# EAGLE design light_controller (EAGLE 9.1.3)
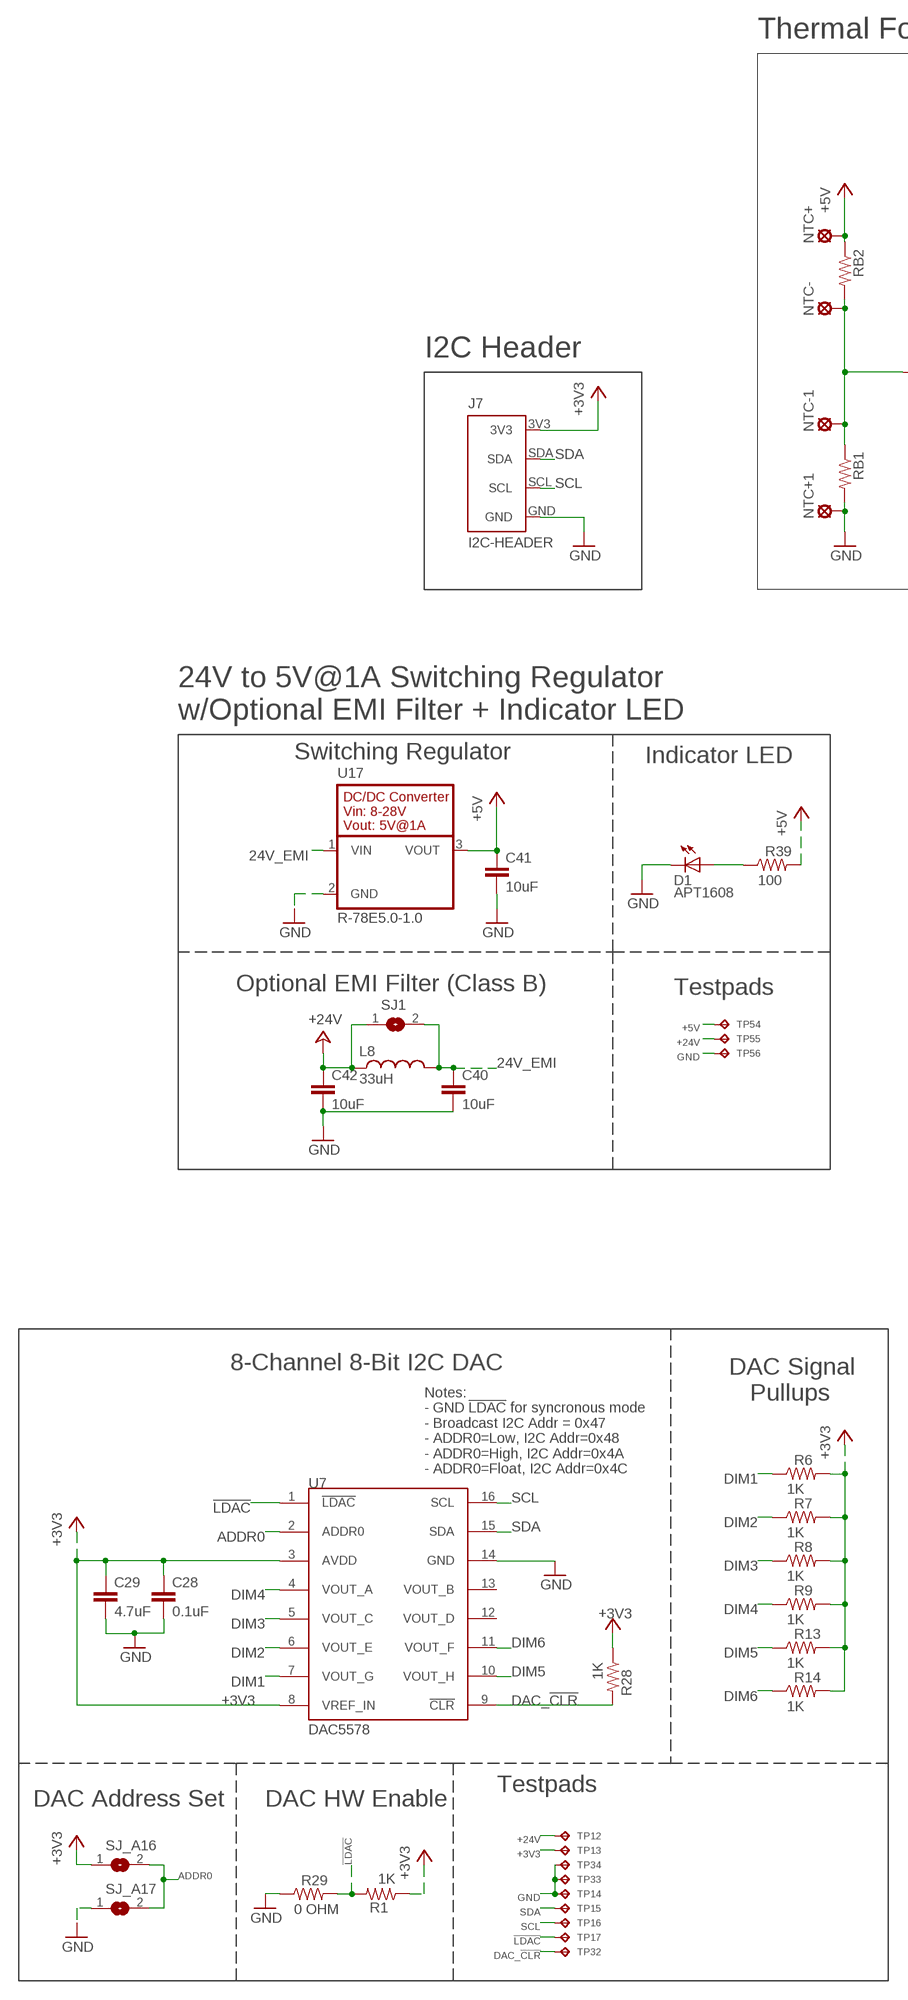
[diagram p0: schematic, sheet 1, part 1 of 2]
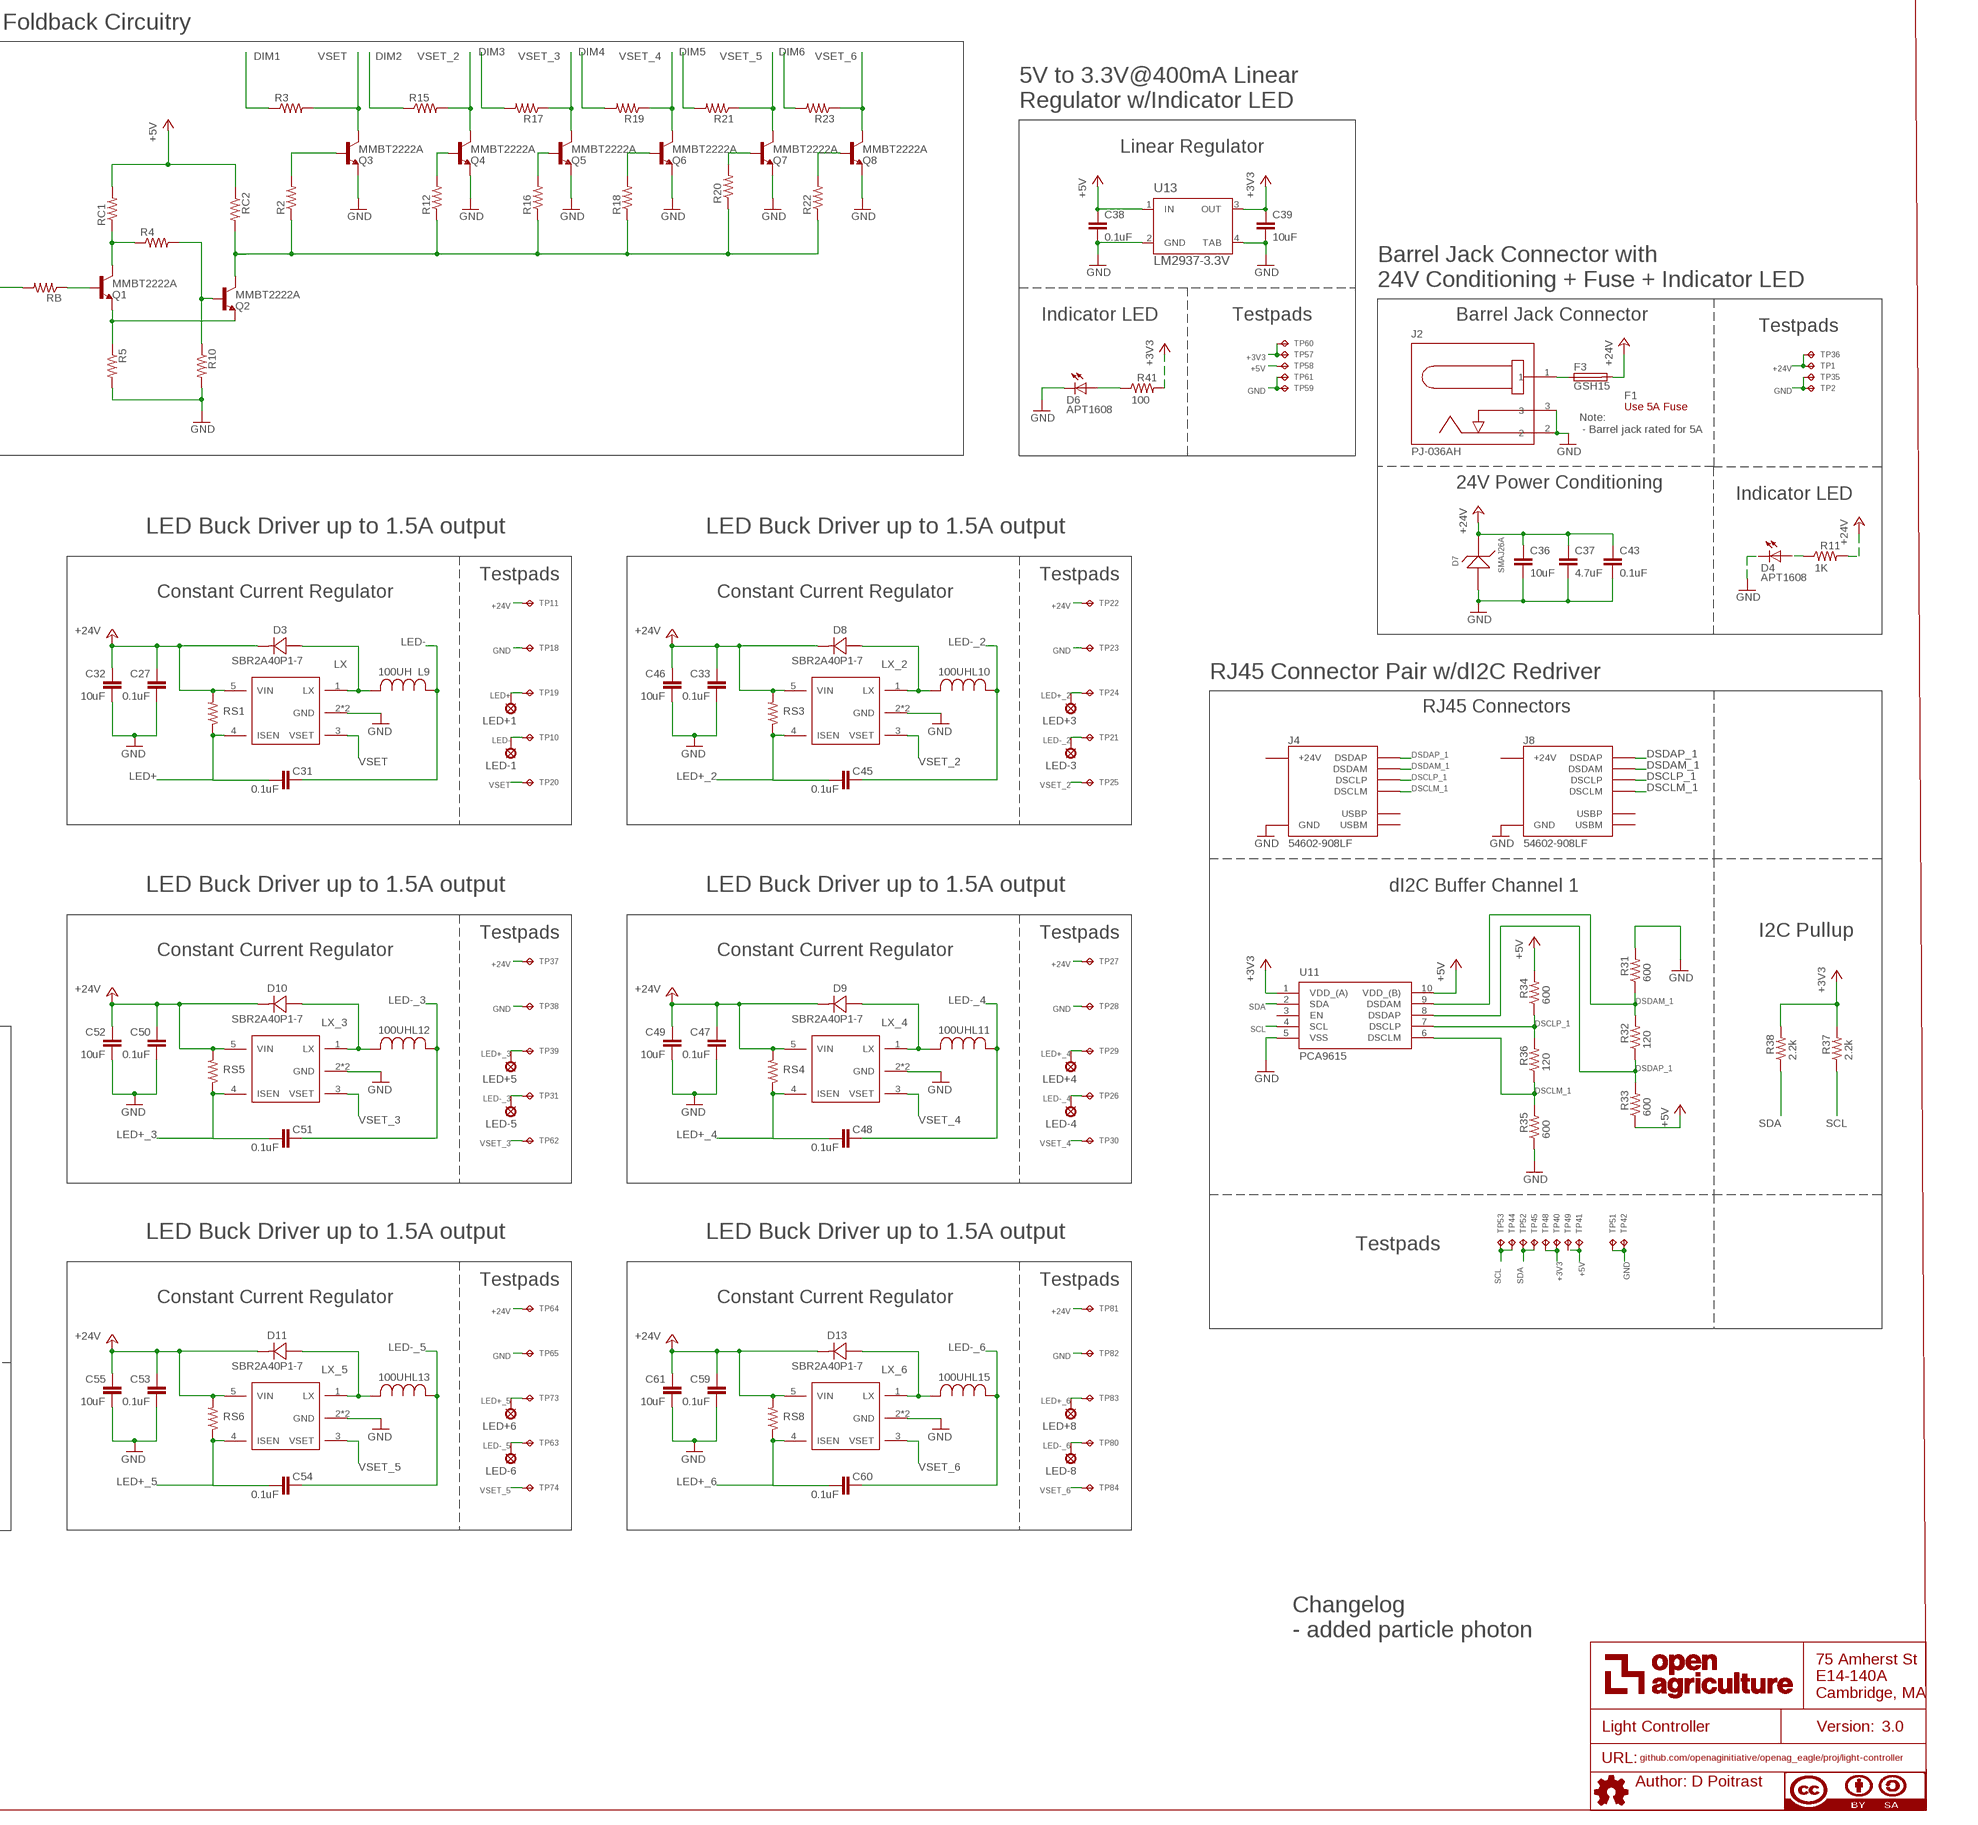
[diagram p1: schematic, sheet 1, part 2 of 2]

## Parts
C27  0.1uF  0.1UF-C0603C104K5RACTU  [C0603]
C28  0.1uF  0.1UF-C0603C104K5RACTU  [C0603]
C29  4.7uF  4.7UF-CL21A475KBQNNNE  [C0805]
C31  0.1uF  0.1UF-C0603C104K5RACTU  [C0603]
C32  10uF  10UF-GMK212BBJ106KG-T  [C0805]
C33  0.1uF  0.1UF-C0603C104K5RACTU  [C0603]
C36  10uF  10UF-GMK212BBJ106KG-T  [C0805]
C37  4.7uF  4.7UF-CL21A475KBQNNNE  [C0805]
C38  0.1uF  0.1UF-C0603C104K5RACTU  [C0603]
C39  10uF  10UF-GMK212BBJ106KG-T  [C0805]
C40  10uF  10UF-GMK212BBJ106KG-T  [C0805]
C41  10uF  10UF-GMK212BBJ106KG-T  [C0805]
C42  10uF  10UF-GMK212BBJ106KG-T  [C0805]
C43  0.1uF  0.1UF-C0603C104K5RACTU  [C0603]
C45  0.1uF  0.1UF-C0603C104K5RACTU  [C0603]
C46  10uF  10UF-GMK212BBJ106KG-T  [C0805]
C47  0.1uF  0.1UF-C0603C104K5RACTU  [C0603]
C48  0.1uF  0.1UF-C0603C104K5RACTU  [C0603]
C49  10uF  10UF-GMK212BBJ106KG-T  [C0805]
C50  0.1uF  0.1UF-C0603C104K5RACTU  [C0603]
C51  0.1uF  0.1UF-C0603C104K5RACTU  [C0603]
C52  10uF  10UF-GMK212BBJ106KG-T  [C0805]
C53  0.1uF  0.1UF-C0603C104K5RACTU  [C0603]
C54  0.1uF  0.1UF-C0603C104K5RACTU  [C0603]
C55  10uF  10UF-GMK212BBJ106KG-T  [C0805]
C59  0.1uF  0.1UF-C0603C104K5RACTU  [C0603]
C60  0.1uF  0.1UF-C0603C104K5RACTU  [C0603]
C61  10uF  10UF-GMK212BBJ106KG-T  [C0805]
D1  APT1608  APT1608CGCK  [CHIPLED_0603]
D3  SBR2A40P1-7  [POWERDI123]
D4  APT1608  APT1608CGCK  [CHIPLED_0603]
D6  APT1608  APT1608CGCK  [CHIPLED_0603]
D7  SMAJ26A  SMAJ26A-13-F  [SMA]
D8  SBR2A40P1-7  [POWERDI123]
D9  SBR2A40P1-7  [POWERDI123]
D10  SBR2A40P1-7  [POWERDI123]
D11  SBR2A40P1-7  [POWERDI123]
D13  SBR2A40P1-7  [POWERDI123]
F1  Use 5A Fuse  0217005.MXP  [FUSE-CARTRIDGE]
F3  GSH15  [GSH15]
J2  PJ-036AH  BARREL-JACK-PJ-036AH-SMT-TR  [BARREL-JACK-PJ-036AH]
J4  54602-908LF  RJ45-DI2C-USB-54602-908LFPTH  [RJ45-DI2C-USB-54602-908LF]
J7  I2C-HEADER  HEADER-I2C  [HEADER-I2C]
J8  54602-908LF  RJ45-DI2C-USB-54602-908LFPTH  [RJ45-DI2C-USB-54602-908LF]
L8  33uH  33UH-29333C  [29333C]
L9  100UH  100UH_BOURNES  [IND_BOURNS_SDR1307]
L10  100UH  100UH_BOURNES  [IND_BOURNS_SDR1307]
L11  100UH  100UH_BOURNES  [IND_BOURNS_SDR1307]
L12  100UH  100UH_BOURNES  [IND_BOURNS_SDR1307]
L13  100UH  100UH_BOURNES  [IND_BOURNS_SDR1307]
L15  100UH  100UH_BOURNES  [IND_BOURNS_SDR1307]
LED+1  SE14  [SE14]
LED+3  SE14  [SE14]
LED+4  SE14  [SE14]
LED+5  SE14  [SE14]
LED+6  SE14  [SE14]
LED+8  SE14  [SE14]
LED-1  SE14  [SE14]
LED-3  SE14  [SE14]
LED-4  SE14  [SE14]
LED-5  SE14  [SE14]
LED-6  SE14  [SE14]
LED-8  SE14  [SE14]
NTC+  SE14  [SE14]
NTC+1  SE14  [SE14]
NTC-  SE14  [SE14]
NTC-1  SE14  [SE14]
Q1  MMBT2222A  BCF30SMD  [SOT23-BEC]
Q2  MMBT2222A  BCF30SMD  [SOT23-BEC]
Q3  MMBT2222A  BCF30SMD  [SOT23-BEC]
Q4  MMBT2222A  BCF30SMD  [SOT23-BEC]
Q5  MMBT2222A  BCF30SMD  [SOT23-BEC]
Q6  MMBT2222A  BCF30SMD  [SOT23-BEC]
Q7  MMBT2222A  BCF30SMD  [SOT23-BEC]
Q8  MMBT2222A  BCF30SMD  [SOT23-BEC]
R1  1K  1K-ERJ-PB3D1001V  [RC0603N]
R2  R-US_R0805W  [R0805W]
R3  R-US_R0805W  [R0805W]
R4  R-US_R0805W  [R0805W]
R5  R-US_R0805W  [R0805W]
R6  1K  1K-ERJ-PB3D1001V  [RC0603N]
R7  1K  1K-ERJ-PB3D1001V  [RC0603N]
R8  1K  1K-ERJ-PB3D1001V  [RC0603N]
R9  1K  1K-ERJ-PB3D1001V  [RC0603N]
R10  R-US_R0805W  [R0805W]
R11  1K  1K-ERJ-PB3D1001V  [RC0603N]
R12  R-US_R0805W  [R0805W]
R13  1K  1K-ERJ-PB3D1001V  [RC0603N]
R14  1K  1K-ERJ-PB3D1001V  [RC0603N]
R15  R-US_R0805W  [R0805W]
R16  R-US_R0805W  [R0805W]
R17  R-US_R0805W  [R0805W]
R18  R-US_R0805W  [R0805W]
R19  R-US_R0805W  [R0805W]
R20  R-US_R0805W  [R0805W]
R21  R-US_R0805W  [R0805W]
R22  R-US_R0805W  [R0805W]
R23  R-US_R0805W  [R0805W]
R28  1K  1K-ERJ-PB3D1001V  [RC0603N]
R29  0 OHM  0OHM-RC0603JR-070RL  [RC0603N]
R31  600  600OHM-RC0603FR-07604RL  [RC0603N]
R32  120  120OHM-RC0603FR-07120RL  [RC0603N]
R33  600  600OHM-RC0603FR-07604RL  [RC0603N]
R34  600  600OHM-RC0603FR-07604RL  [RC0603N]
R35  600  600OHM-RC0603FR-07604RL  [RC0603N]
R36  120  120OHM-RC0603FR-07120RL  [RC0603N]
R37  2.2k  2.2K-RC0603JR-072K2L  [RC0603N]
R38  2.2k  2.2K-RC0603JR-072K2L  [RC0603N]
R39  100  100OHM-RC0603JR-07100RL  [RC0603N]
R41  100  100OHM-RC0603JR-07100RL  [RC0603N]
RB  R-US_R0805W  [R0805W]
RB1  R-US_R0805W  [R0805W]
RB2  R-US_R0805W  [R0805W]
RC1  R-US_R0805W  [R0805W]
RC2  R-US_R0805W  [R0805W]
RS1  6.34 ohm  6.3OHM-RC0805FR-076R34L  [R0805]
RS3  6.34 ohm  6.3OHM-RC0805FR-076R34L  [R0805]
RS4  6.34 ohm  6.3OHM-RC0805FR-076R34L  [R0805]
RS5  6.34 ohm  6.3OHM-RC0805FR-076R34L  [R0805]
RS6  6.34 ohm  6.3OHM-RC0805FR-076R34L  [R0805]
RS8  6.34 ohm  6.3OHM-RC0805FR-076R34L  [R0805]
SJ1  EMI-BYPASS  [EMI-BYPASS]
SJ_A16  SOLDERJUMPERREFLOW_NOPASTE  [SJ1]
SJ_A17  SOLDERJUMPERREFLOW_NOPASTE  [SJ1]
TP1  TPTP04R  [TP04R]
TP2  TPTP04R  [TP04R]
TP10  TPTP06R  [TP06R]
TP11  TPTP06R  [TP06R]
TP12  TPTP04R  [TP04R]
TP13  TPTP04R  [TP04R]
TP14  TPTP04R  [TP04R]
TP15  TPTP04R  [TP04R]
TP16  TPTP04R  [TP04R]
TP17  TPTP04R  [TP04R]
TP18  TPTP06R  [TP06R]
TP19  TPTP06R  [TP06R]
TP20  TPTP06R  [TP06R]
TP21  TPTP06R  [TP06R]
TP22  TPTP06R  [TP06R]
TP23  TPTP06R  [TP06R]
TP24  TPTP06R  [TP06R]
TP25  TPTP06R  [TP06R]
TP26  TPTP06R  [TP06R]
TP27  TPTP06R  [TP06R]
TP28  TPTP06R  [TP06R]
TP29  TPTP06R  [TP06R]
TP30  TPTP06R  [TP06R]
TP31  TPTP06R  [TP06R]
TP32  TPTP04R  [TP04R]
TP33  TPTP04R  [TP04R]
TP34  TPTP04R  [TP04R]
TP35  TPTP04R  [TP04R]
TP36  TPTP04R  [TP04R]
TP37  TPTP06R  [TP06R]
TP38  TPTP06R  [TP06R]
TP39  TPTP06R  [TP06R]
TP40  TPTP04R  [TP04R]
TP41  TPTP04R  [TP04R]
TP42  TPTP04R  [TP04R]
TP44  TPTP04R  [TP04R]
TP45  TPTP04R  [TP04R]
TP48  TPTP04R  [TP04R]
TP49  TPTP04R  [TP04R]
TP51  TPTP04R  [TP04R]
TP52  TPTP04R  [TP04R]
TP53  TPTP04R  [TP04R]
TP54  TPTP06R  [TP06R]
TP55  TPTP06R  [TP06R]
TP56  TPTP06R  [TP06R]
TP57  TPTP04R  [TP04R]
TP58  TPTP04R  [TP04R]
TP59  TPTP04R  [TP04R]
TP60  TPTP04R  [TP04R]
TP61  TPTP04R  [TP04R]
TP62  TPTP06R  [TP06R]
TP63  TPTP06R  [TP06R]
TP64  TPTP06R  [TP06R]
TP65  TPTP06R  [TP06R]
TP73  TPTP06R  [TP06R]
TP74  TPTP06R  [TP06R]
TP80  TPTP06R  [TP06R]
TP81  TPTP06R  [TP06R]
TP82  TPTP06R  [TP06R]
TP83  TPTP06R  [TP06R]
TP84  TPTP06R  [TP06R]
U7  DAC5578  DAC5578SPW  [TSSOP16]
U11  PCA9615  PCA9615DPJ  [SOP50P490X110-10N]
U13  LM2937-3.3V  LM2937IMP-3.3/NOPB  [MP04A]
U17  R-78E5.0-1.0  [R-78E5.0-1.0]
U$6  AUTHOR  [AUTHOR]
U$7  TITLE  [TITLE]
U$11  AL8861  [AL8861]
U$12  AL8861  [AL8861]
U$13  AL8861  [AL8861]
U$14  AL8861  [AL8861]
U$15  AL8861  [AL8861]
U$17  AL8861  [AL8861]

## Nets
24V_EMI: C40.1 L8.2 SJ1.2 U17.1(VIN)
24V_IN: F3.1 J2.1
!LDAC!: R1.2 R29.2 TP17.1(TP) U7.1(!LDAC!)
+3V3: C28.1 C29.1 C39.1 J7.3V3 R1.1 R6.2 R7.2 R8.2 R9.2 R13.2 R14.2 R28.1 R37.2 R38.2 R41.2 SJ_A16.1 TP13.1(TP) TP40.1(TP) TP48.1(TP) TP57.1(TP) TP60.1(TP) U7.3(AVDD) U7.8(VREF_IN) U11.1(VDD_(A)) U13.3(OUT)
+5V: C38.1 C41.1 NTC+.MP R33.1 R34.2 R39.2 RB2.1 RC1.2 RC2.1 TP41.1(TP) TP49.1(TP) TP54.TP TP58.1(TP) U11.10(VDD_(B)) U13.1(IN) U17.3(VOUT)
+24V: C27.1 C32.1 C33.1 C36.1 C37.1 C42.1 C43.1 C46.1 C47.1 C49.1 C50.1 C52.1 C53.1 C55.1 C59.1 C61.1 D3.- D7.1 D8.- D9.- D10.- D11.- D13.- F3.2 L8.1 R11.2 RS1.2 RS3.2 RS4.2 RS5.2 RS6.2 RS8.2 SJ1.1 TP1.1(TP) TP11.TP TP12.1(TP) TP22.TP TP27.TP TP36.1(TP) TP37.TP TP55.TP TP64.TP TP81.TP U$11.5(VIN) U$12.5(VIN) U$13.5(VIN) U$14.5(VIN) U$15.5(VIN) U$17.5(VIN)
ADDR0: SJ_A16.2 SJ_A17.2 U7.2(ADDR0)
DAC_!CLR!: R28.2 TP32.1(TP) U7.9(!CLR!)
DIM1: R3.1 R6.1 U7.7(VOUT_G)
DIM2: R7.1 R15.1 U7.6(VOUT_E)
DIM3: R8.1 R17.2 U7.5(VOUT_C)
DIM4: R9.1 R19.2 U7.4(VOUT_A)
DIM5: R13.1 R21.2 U7.10(VOUT_H)
DIM6: R14.1 R23.2 U7.11(VOUT_F)
DSCLM_1: J4.DSCLM(5)(DSCLM) J8.DSCLM(5)(DSCLM) R35.2 R36.1 U11.6(DSCLM)
DSCLP_1: J4.DSCLP(4)(DSCLP) J8.DSCLP(4)(DSCLP) R34.1 R36.2 U11.7(DSCLP)
DSDAM_1: J4.DSDAM(2)(DSDAM) J8.DSDAM(2)(DSDAM) R31.1 R32.2 U11.9(DSDAM)
DSDAP_1: J4.DSDAP(1)(DSDAP) J8.DSDAP(1)(DSDAP) R32.1 R33.2 U11.8(DSDAP)
GND: C27.2 C28.2 C29.2 C32.2 C33.2 C36.2 C37.2 C38.2 C39.2 C40.2 C41.2 C42.2 C43.2 C46.2 C47.2 C49.2 C50.2 C52.2 C53.2 C55.2 C59.2 C61.2 D1.C D4.C D6.C D7.2 J2.2 J2.3 J4.GND(3)(GND) J7.GND J8.GND(3)(GND) NTC+1.MP Q3.E Q4.E Q5.E Q6.E Q7.E Q8.E R5.2 R10.2 R29.1 R31.2 R35.1 RB1.2 SJ_A17.1 TP2.1(TP) TP14.1(TP) TP18.TP TP23.TP TP28.TP TP33.1(TP) TP34.1(TP) TP35.1(TP) TP38.TP TP42.1(TP) TP51.1(TP) TP56.TP TP59.1(TP) TP61.1(TP) TP65.TP TP82.TP U7.14(GND) U11.5(VSS) U13.2(GND) U13.4(TAB) U17.2(GND) U$11.2(GND) U$11.44(GND) U$12.2(GND) U$12.44(GND) U$13.2(GND) U$13.44(GND) U$14.2(GND) U$14.44(GND) U$15.2(GND) U$15.44(GND) U$17.2(GND) U$17.44(GND)
LED+: C31.2 LED+1.MP RS1.1 TP19.TP U$11.4(ISEN)
LED+_2: C45.2 LED+3.MP RS3.1 TP24.TP U$12.4(ISEN)
LED+_3: C51.2 LED+5.MP RS5.1 TP39.TP U$14.4(ISEN)
LED+_4: C48.2 LED+4.MP RS4.1 TP29.TP U$13.4(ISEN)
LED+_5: C54.2 LED+6.MP RS6.1 TP73.TP U$15.4(ISEN)
LED+_6: C60.2 LED+8.MP RS8.1 TP83.TP U$17.4(ISEN)
LED-: C31.1 L9.2 LED-1.MP TP10.TP
LED-_2: C45.1 L10.2 LED-3.MP TP21.TP
LED-_3: C51.1 L12.2 LED-5.MP TP31.TP
LED-_4: C48.1 L11.2 LED-4.MP TP26.TP
LED-_5: C54.1 L13.2 LED-6.MP TP63.TP
LED-_6: C60.1 L15.2 LED-8.MP TP80.TP
LX: D3.+ L9.1 U$11.1(LX)
LX_2: D8.+ L10.1 U$12.1(LX)
LX_3: D10.+ L12.1 U$14.1(LX)
LX_4: D9.+ L11.1 U$13.1(LX)
LX_5: D11.+ L13.1 U$15.1(LX)
LX_6: D13.+ L15.1 U$17.1(LX)
N$1: D1.A R39.1
N$3: D6.A R41.1
N$4: D4.A R11.1
N$5: Q1.B RB.1
N$6: Q1.C R4.1 RC1.1
N$7: Q1.E Q2.E R5.1
N$8: Q3.B R2.2
N$9: Q2.B R4.2 R10.1
N$10: Q4.B R12.2
N$11: Q2.C R2.1 R12.1 R16.1 R18.1 R20.1 R22.1 RC2.2
N$12: Q5.B R16.2
N$22: Q6.B R18.2
N$23: Q7.B R20.2
N$24: Q8.B R22.2
N$25: NTC-1.MP NTC-.MP RB1.1 RB2.2 RB.2
SCL: J7.SCL R37.1 TP16.1(TP) TP44.1(TP) TP53.1(TP) U7.16(SCL) U11.4(SCL)
SDA: J7.SDA R38.1 TP15.1(TP) TP45.1(TP) TP52.1(TP) U7.15(SDA) U11.2(SDA)
VSET: Q3.C R3.2 TP20.TP U$11.3(VSET)
VSET_2: Q4.C R15.2 TP25.TP U$12.3(VSET)
VSET_3: Q5.C R17.1 TP62.TP U$14.3(VSET)
VSET_4: Q6.C R19.1 TP30.TP U$13.3(VSET)
VSET_5: Q7.C R21.1 TP74.TP U$15.3(VSET)
VSET_6: Q8.C R23.1 TP84.TP U$17.3(VSET)
Unconnected: J4.24V(6)(+24V) J4.USBM(8)(USBM) J4.USBP(7)(USBP) J8.24V(6)(+24V) J8.USBM(8)(USBM) J8.USBP(7)(USBP) U7.12(VOUT_D) U7.13(VOUT_B) U11.3(EN)

## Notes on the sheet
- 6-Channel 24V, 700mA (per channel) Current Regulator Module w/I2C Controlled Dimming via PWM or Analog Signaling
- Thermal Foldback Circuitry
- 5V to 3.3V@400mA Linear 
  Regulator w/Indicator LED
- Linear Regulator
- I2C Header
- Barrel Jack Connector with
  24V Conditioning + Fuse + Indicator LED
- Indicator LED | Testpads | Barrel Jack Connector
- Testpads
- Note:
   - Barrel jack rated for 5A
- 24V Power Conditioning
- Indicator LED
- LED Buck Driver up to 1.5A output | LED Buck Driver up to 1.5A output
- 24V to 5V@1A Switching Regulator
  w/Optional EMI Filter + Indicator LED
- Testpads | Testpads
- Switching Regulator | Indicator LED
- Constant Current Regulator | Constant Current Regulator
- RJ45 Connector Pair w/dI2C Redriver
- RJ45 Connectors
- Optional EMI Filter (Class B) | Testpads
- LED Buck Driver up to 1.5A output | LED Buck Driver up to 1.5A output | dI2C Buffer Channel 1
- Testpads | Testpads | I2C Pullup
- Constant Current Regulator | Constant Current Regulator
- 8-Channel 8-Bit I2C DAC
- DAC Signal 
     Pullups
- Notes:
  - GND !LDAC! for syncronous mode
  - Broadcast I2C Addr = 0x47
  - ADDR0=Low, I2C Addr=0x48
  - ADDR0=High, I2C Addr=0x4A
  - ADDR0=Float, I2C Addr=0x4C
- LED Buck Driver up to 1.5A output | LED Buck Driver up to 1.5A output
- Testpads
- Testpads | Testpads
- Constant Current Regulator | Constant Current Regulator
- Testpads
- DAC Address Set | DAC HW Enable
- Changelog
  - added particle photon

## Library data of the parts
C27 C28 C31 C33 C38 C43 C45 C47 C48 C50 C51 C53 C54 C59 C60 = openag-capacitors:0.1UF-C0603C104K5RACTU: CAP CER 0.1UF 50V X7R 0603 Description: 0.1µF ±10% 50V Ceramic Capacitor X7R 0603 (1608 Metric) Technical Specifications: Capacitance: 0.1µF Tolerance: ±10% Rated Voltage: 50V Temperature Coefficient: X7R Operating Temperature: -55°C ~ 125°C Package / Case: 0603 (1608 Metric) Datasheet(s): X7R Dielectric, 6.3-250 VDC <https://search.kemet.com/component-edge/download/datasheet/C0603C104K5RACTU.pdf> Vendor(s): Digikey: 399-5089-1-ND <https://www.digikey.com/product-detail/en/kemet/C0603C104K5RACTU/399-5089-1-ND/1465623>; MANUFACTURER: Kemet; MPN: C0603C104K5RACTU; VENDOR: Digikey; VLINK: https://www.digikey.com/product-detail/en/kemet/C0603C104K5RACTU/399-5089-1-ND/1465623; VPN: 399-5089-1-ND
C29 C37 = openag-capacitors:4.7UF-CL21A475KBQNNNE: CAP CER 4.7UF 50V X5R 0805 Description: 4.7µF ±10% 50V Ceramic Capacitor X5R 0805 (2012 Metric) Technical Specifications: Capacitance: 4.7uF Tolerance: ±10% Rated Voltage: 50V Temperature Coefficient: X5R Operating Temperature: -55°C ~ 85°C Package/Case: 0805 (2012 Metric) Datasheet(s): CL21A475KBQNNNE Characteristics <http://www.samsungsem.com/kr/front/downloadcms.do?path=/kr/support/product-search/mlcc/__icsFiles/afieldfile/2014/11/05&fileName=C_CL21A475KBQNNNE.pdf> Vendor(s): Digikey: 1276-1248-1-ND <https://www.digikey.com/product-detail/en/samsung-electro-mechanics/CL21A475KBQNNNE/1276-1248-1-ND/3889334>; MANUFACTURER: Samsung; MPN: CL21A475KBQNNNE; VENDOR: Digikey; VLINK: https://www.digikey.com/product-detail/en/samsung-electro-mechanics/CL21A475KBQNNNE/1276-1248-1-ND/3889334; VPN: 1276-1248-1-ND
C32 C36 C39-C42 C46 C49 C52 C55 C61 = openag-capacitors:10UF-GMK212BBJ106KG-T: CAP CER 10UF 35V X5R 0805 Description: 10µF ±10% 35V Ceramic Capacitor X5R 0805 (2012 Metric) Technical Specifications: Capacitance: 10µF Tolerance: ±10% Rated Voltage: 35V Temperature Coefficient: X5R Operating Temperature: -55°C ~ 85°C Package / Case: 0805 (2012 Metric) Datasheet(s): GMK212BBJ106KG-T Spec <http://ds.yuden.co.jp/TYCOMPAS/ut/detail.do?productNo=GMK212BBJ106KG-T&fileName=GMK212BBJ106KG-T_SS&mode=specSheetDownload> Vendor(s): Digikey: 587-4893-1-ND <https://www.digikey.com/product-detail/en/taiyo-yuden/GMK212BBJ106KG-T/587-4893-1-ND/6563736>; MANUFACTURER: Taiyo Yuden; MPN: GMK212BBJ106KG-T; VENDOR: Digikey; VLINK: https://www.digikey.com/product-detail/en/taiyo-yuden/GMK212BBJ106KG-T/587-4893-1-ND/6563736; VPN: 587-4893-1-ND
D1 D4 D6 = openag-diodes:APT1608CGCK: LED GREEN CLEAR 0603 SMD Description: Green 570nm LED Indication - Discrete 2.1V 0603 (1608 Metric) Technical Specifications: Color: Green Lens Color: Colorless Lens Transparency: Clear Millicandela Rating: 50mcd Lens Style/Size: Rectangle with Flat Top, 1.20mm x 0.80mm Voltage - Forward (Vf) (Typ): 2.1V Current - Test: 20mA Viewing Angle: 120° Mounting Type: Surface Mount Wavelength - Dominant: 570nm Wavelength - Peak: 574nm Package / Case: 0603 (1608 Metric) Supplier Device Package: Chip LED Size / Dimension: 1.60mm L x 0.80mm W Height (Max): 0.75mm Datasheet(s): APT1608CGCK <http://www.kingbrightusa.com/images/catalog/SPEC/APT1608CGCK.pdf> Vendor(s): Digikey: 754-1116-1-ND <https://www.digikey.com/product-detail/en/kingbright/APT1608CGCK/754-1116-1-ND/1747833#>; MANUFACTURER: Kingbright; MPN: APT1608CGCK; VENDOR: Digikey; VLINK: https://www.digikey.com/product-detail/en/kingbright/APT1608CGCK/754-1116-1-ND/1747833#; VPN: 754-1116-1-ND
D3 D8-D11 D13 = openag-diodes:SBR2A40P1-7: DIODE SBR 40V 2A POWERDI123 Description: Diode Super Barrier 40V 2A Surface Mount PowerDI™ 123 Technical Specifications: Diode Type: Super Barrier Voltage - DC Reverse (Vr) (Max): 40V Current - Average Rectified (Io): 2A Voltage - Forward (Vf) (Max) @ If: 500mV @ 2A Speed: Standard Recovery >500ns, > 200mA (Io) Current - Reverse Leakage @ Vr: 100µA @ 40V Mounting Type: Surface Mount Package / Case: POWERDI®123 Supplier Device Package: PowerDI™ 123 Operating Temperature - Junction: -65°C ~ 150°C Base Part Number: SBR2A40 Datasheet(s): SBR2A40P1 <https://www.diodes.com/assets/Datasheets/SBR2A40P1.pdf> Vendor(s): Digikey: SBR2A40P1DITR-ND <https://www.digikey.com/product-detail/en/diodes-incorporated/SBR2A40P1-7/SBR2A40P1DITR-ND/1681825>; MANUFACTURER: Diodes Incorporated; MPN: SBR2A40P1-7; VENDOR: Digikey; VLINK: https://www.digikey.com/product-detail/en/diodes-incorporated/SBR2A40P1-7/SBR2A40P1DITR-ND/1681825; VPN: SBR2A40P1DITR-ND
D7 = openag-diodes:SMAJ26A-13-F: TVS DIODE 26VWM 42.1VC SMA Description: TVS DIODE 26VWM 42.1VC SMA Technical Specifications: Type: Zener Voltage - Reverse Standoff (Typ): 26V Voltage - Breakdown (Min): 28.9V Voltage - Clamping (Max) @ Ipp: 42.1V Current - Peak Pulse (10/1000µs): 9.5A Power - Peak Pulse: 400W Power Line Protection: No Operating Temperature: -55°C ~ 150°C (TJ) DO-214AC, SMA Datasheet(s): SMAJ5.0(C)A - SMAJ200(C)A Vendor(s): Digikey: SMAJ26A-FDICT-ND <https://www.digikey.com/product-detail/en/diodes-incorporated/SMAJ26A-13-F/SMAJ26A-FDICT-ND/806583>; MANUFACTURER: Diodes Incorporated; MPN: SMAJ26A-13-F; VENDOR: Digikey; VLINK: https://www.digikey.com/product-detail/en/diodes-incorporated/SMAJ26A-13-F/SMAJ26A-FDICT-ND/806583; VPN: SMAJ26A-FDICT-ND
F1 = openag-fuses:0217005.MXP: FUSE GLASS 5A 250VAC 5X20MM Description: FUSE GLASS 5A 250VAC 5X20MM Technical Specifications: Fuse Type: Cartridge, Glass Current Rating: 5A Voltage Rating - AC: 250V Response Time: Fast Package / Case: 5mm x 20mm Mounting Type: Holder Breaking Capacity @ Rated Voltage: 50A Melting I²t: 42.795 Approvals: BSI, CE, CCC, CSA, KC, PSE, SEMKO, UR, VDE Operating Temperature: -55°C ~ 125°C Size / Dimension: 0.205" Dia x 0.787" L (5.20mm x 20.00mm) DC Cold Resistance: 0.0137 Ohms Datasheet(s): 217 Series Datasheet <http://www.littelfuse.com/~/media/electronics/datasheets/fuses/littelfuse_fuse_217_datasheet.pdf.pdf> Vendor(s): Digikey: F1725-ND <https://www.digikey.com/product-detail/en/littelfuse-inc/0217005.MXP/F1725-ND/777549#>; MANUFACTURER: Littelfuse Inc.; MPN: 0217005.MXP; VENDOR: Digikey; VLINK: https://www.digikey.com/product-detail/en/littelfuse-inc/0217005.MXP/F1725-ND/777549; VPN: F1725-ND
F3 = openag-fuses:GSH15: FUSE BLOCK CART 250V 6.3A PCB Description: Fuse Block 6.3A 250V 1 Circuit Cartridge PCB Technical Specifications: Fuseholder Type: Block Fuse Type: Cartridge For Use With/Related Products: 5mm x 20mm Fuse Size: 5mm x 20mm Number of Circuits: 1 Voltage: 250V Current Rating: 6.3A Mounting Type: PCB Orientation: Horizontal Termination Style: PC Pin Contact Material: Copper Alloy Contact Finish: Tin Datasheet(s): 649 Series <http://www.littelfuse.com/~/media/electronics/datasheets/fuse_blocks/littelfuse_fuse_block_649_datasheet.pdf.pdf> Vendor(s): Digikey: WK0011-ND <https://www.digikey.com/product-detail/en/littelfuse-inc/64900001039/WK0011-ND/245470>; MANUFACTURER: Littelfuse Inc.; MPN: 64900001039; VENDOR: Digikey; VLINK: https://www.digikey.com/product-detail/en/littelfuse-inc/64900001039/WK0011-ND/245470; VPN: WK0011-ND
J2 = openag-connectors:BARREL-JACK-PJ-036AH-SMT-TR: CONN PWR JACK 2X5.5MM SOLDER Description: Power Barrel Connector Jack 2.10mm ID (0.083"), 5.50mm OD (0.217") Surface Mount, Right Angle Technical Specifications: Connector Type: Jack Gender: Male Industry Recognized Mating Diameter: 2.10mm ID (0.083"), 5.50mm OD (0.217") Actual Diameter: 0.078" (2.00mm ID), 0.248" (6.30mm OD) Number of Positions/Contacts: 2 Conductors, 3 Contacts Internal Switch(s): Single Switch, Normally Closed Mounting Type: Surface Mount, Right Angle Termination: Solder Shielding: Unshielded Voltage - Rated: 24VDC Current Rating: 5A Mating Length/Depth: 0.360" (9.15mm) Contact Material - Plating: Silver Operating Temperature: -25°C ~ 85°C Housing Material: Polyamide (PA6T), Nylon 6T Contact Material: Brass; Copper Alloy Body Color: Black Datasheet(s): PJ-036AH-SMT-TR <http://www.cui.com/product/resource/digikeypdf/pj-036ah-smt-tr.pdf> Vendor(s): Digikey: CP-036AHPJCT-ND <https://www.digikey.com/product-detail/en/cui-inc/PJ-036AH-SMT-TR/CP-036AHPJCT-ND/1530994>; MANUFACTURER: CUI Inc.; MPN: PJ-036AH-SMT-TR; VENDOR: Digikey; VLINK: https://www.digikey.com/product-detail/en/cui-inc/PJ-036AH-SMT-TR/CP-036AHPJCT-ND/1530994; VPN: CP-036AHPJCT-ND
J4 J8 = openag-connectors:RJ45-DI2C-USB-54602-908LF: CONN MOD JACK 8P8C R/A UNSHLD Description: Jack Modular Connector 8p8c (RJ45, Ethernet) 90° Angle (Right) Unshielded Cat3 Technical Specifications: Connector Type: Jack Number of Positions/Contacts: 8p8c (RJ45, Ethernet) Number of Ports: 1 Number of Rows: 1 Mounting Type: Through Hole Orientation: 90° Angle (Right) Termination: Solder Shielding: Unshielded Ratings: Cat3 Features: Board Lock LED Color: Does Not Contain LED Tab Direction: Down Contact Material: Copper Alloy Contact Finish: Gold Contact Finish Thickness: 15µin (0.38µm) Housing Material: Polyester, Glass Filled Operating Temperature: -40°C ~ 70°C Datasheet(s): 54601-x04(zzz)WPLF Drawing <http://cdn.amphenol-icc.com/media/wysiwyg/files/drawing/c-bmj-0102.pdf> Vendor(s): Digikey: 609-1046-ND <https://www.digikey.com/product-detail/en/amphenol-fci/54602-908LF/609-1046-ND/1001360>; MANUFACTURER: Amphenol FCI; MPN: 54602-908LF; VENDOR: Digikey; VLINK: https://www.digikey.com/product-detail/en/amphenol-fci/54602-908LF/609-1046-ND/1001360; VPN: 609-1046-ND
J7 = openag-connectors:HEADER-I2C: 100 MIL HEADER I2C CONNECTIONS; MPN: N/A
L8 = openag-inductors:33UH-29333C: FIXED IND 33UH 1A 120 MOHM SMD Description: 33µH Shielded Wirewound Inductor 1A 120 mOhm Max Nonstandard Technical Specifications: Type: Wirewound Inductance: 33µH Current Rating: 1A Shielding: Shielded DC Resistance (DCR): 120 mOhm Max Operating Temperature: -40°C ~ 85°C Frequency - Test: 10kHz Mounting Type: Surface Mount Package / Case: Nonstandard Size / Dimension: 0.283" L x 0.283" W (7.20mm x 7.20mm) Height - Seated (Max): 0.157" (4.00mm) Datasheet(s): 2900 Series <https://www.murata-ps.com/data/magnetics/kmp_2900.pdf> Vendor(s): Digikey: 811-1138-1-ND <https://www.digikey.com/product-detail/en/murata-power-solutions-inc/29333C/811-1138-1-ND/1924860>; MANUFACTURER: Murata Power Solutions Inc.; MPN: 29333C; VENDOR: Digikey; VLINK: https://www.digikey.com/product-detail/en/murata-power-solutions-inc/29333C/811-1138-1-ND/1924860; VPN: 811-1138-1-ND
L9-L13 L15 = openag-inductors:100UH_BOURNES: Bourne - FIXED IND 100UH 1.9A 180 MOHM Technical Specifications: Inductance: 100uH Rated Current: 1.9A Saturation Current: 3.0A DC Resistance: 180mΩ Operating Temperature: -40° C to 125°C Datasheet(s): 100uH Bourne <http://www.bourns.com/docs/Product-Datasheets/SDR1307.pdf> Vendors: Digikey: SDR1307-101KLCT-ND <https://www.digikey.com/product-detail/en/bourns-inc/SDR1307-101KL/SDR1307-101KLCT-ND/3437739>
LED+1 LED+3-LED+6 LED+8 LED-1 LED-3-LED-6 LED-8 NTC+ NTC+1 NTC- NTC-1 = solpad:SE14: SOLDER PAD E1553, drill 1,4mm, distributor Buerklin, 07F820
Q1-Q8 = transistor-npn:BCF30*: NPN Transistor
R1 R6-R9 R11 R13 R14 R28 = openag-resistors:1K-ERJ-PB3D1001V: RES SMD 1K OHM 0.5% 1/5W 0603 Description: 1 kOhms ±0.5% 0.2W, 1/5W Chip Resistor 0603 (1608 Metric) Automotive AEC-Q200, Pulse Withstanding Thick Film Technical Specifications: Resistance: 1 kOhms Tolerance: ±0.5% Power: 0.2W, 1/5W Operating Temperature: -55°C ~ 155°C Package / Case: 0603 (1608 Metric) Datasheet(s): ERJ-PB3, PB6 Series, High Precision Datasheet <https://industrial.panasonic.com/cdbs/www-data/pdf/RDM0000/AOA0000C328.pdf> Vendor(s): Digikey: P20283CT-ND <https://www.digikey.com/product-detail/en/panasonic-electronic-components/ERJ-PB3D1001V/P20283CT-ND/6214538>; MANUFACTURER: Panasonic; MPN: P20283CT-ND; VENDOR: Digikey; VLINK: https://www.digikey.com/product-detail/en/panasonic-electronic-components/ERJ-PB3D1001V/P20283CT-ND/6214538; VPN: P20283CT-ND
R2-R5 R10 R12 R15-R23 RB RB1 RB2 RC1 RC2 = rcl:R-US_: RESISTOR, American symbol; SPICEPREFIX: R
R29 = openag-resistors:0OHM-RC0603JR-070RL: RES SMD 0 OHM JUMPER 1/10W 0603 Description: 0 Ohms Jumper 0.1W, 1/10W Chip Resistor 0603 (1608 Metric) Moisture Resistant Thick Film Technical Specifications: Resistance: 0 Ohms Power: 0.1W, 1/10W Operating Temperature: -55°C ~ 155°C Package / Case: 0603 (1608 Metric) Datasheet(s): RC Series, L Datasheet <http://www.yageo.com/documents/recent/PYu-RC_Group_51_RoHS_L_8.pdf> Vendor(s): Digikey: 311-0.0GRCT-ND <https://www.digikey.com/product-detail/en/yageo/RC0603JR-070RL/311-0.0GRCT-ND/729622>; MANUFACTURER: Yageo; MPN: RC0603JR-070RL; VENDOR: Digikey; VLINK: https://www.digikey.com/product-detail/en/yageo/RC0603JR-070RL/311-0.0GRCT-ND/729622; VPN: 311-0.0GRCT-ND
R31 R33-R35 = openag-resistors:600OHM-RC0603FR-07604RL: RES SMD 604 OHM 1% 1/10W 0603 Description: 604 Ohms ±1% 0.1W, 1/10W Chip Resistor 0603 (1608 Metric) Moisture Resistant Thick Film Technical Specifications: Resistance: 604 Ohms Tolerance: ±1% Power (Watts): 0.1W, 1/10W Composition: Thick Film Features: Moisture Resistant Temperature Coefficient: ±100ppm/°C Operating Temperature: -55°C ~ 155°C Package / Case: 0603 (1608 Metric) Supplier Device Package: 0603 Size / Dimension: 0.063" L x 0.032" W (1.60mm x 0.80mm) Height - Seated (Max): 0.022" (0.55mm) Number of Terminations: 2 Datasheet(s): RC Series, L Datasheet <http://www.yageo.com/documents/recent/PYu-RC_Group_51_RoHS_L_8.pdf> Chip Resistor Marking <http://www.yageo.com/exep/pages/download/literatures/PYu-R_Marking_2.pdf> Vendor(s): Digikey: 311-604HRCT-ND <https://www.digikey.com/product-detail/en/yageo/RC0603FR-07604RL/311-604HRCT-ND/730276>; MANUFACTURER: Yageo; MPN: RC0603FR-07604RL; VENDOR: Digikey; VLINK: https://www.digikey.com/product-detail/en/yageo/RC0603FR-07604RL/311-604HRCT-ND/730276; VPN: 311-604HRCT-ND
R32 R36 = openag-resistors:120OHM-RC0603FR-07120RL: RES SMD 120 OHM 1% 1/10W 0603 Description: 120 Ohms ±1% 0.1W, 1/10W Chip Resistor 0603 (1608 Metric) Moisture Resistant Thick Film Technical Specifications: Resistance: 120 Ohms Tolerance: ±1% Power (Watts): 0.1W, 1/10W Composition: Thick Film Features: Moisture Resistant Temperature Coefficient: ±100ppm/°C Operating Temperature: -55°C ~ 155°C Package / Case: 0603 (1608 Metric) Supplier Device Package: 0603 Size / Dimension: 0.063" L x 0.032" W (1.60mm x 0.80mm) Height - Seated (Max): 0.022" (0.55mm) Number of Terminations: 2 Datasheet(s): RC Series, L Datasheet <http://www.yageo.com/documents/recent/PYu-RC_Group_51_RoHS_L_8.pdf> Chip Resistor Marking <http://www.yageo.com/exep/pages/download/literatures/PYu-R_Marking_2.pdf> Vendor(s): Digikey: 311-120HRCT-ND <https://www.digikey.com/product-detail/en/yageo/RC0603FR-07120RL/311-120HRCT-ND/729867>; MANUFACTURER: Yageo; MPN: RC0603FR-07120RL; VENDOR: Digikey; VLINK: https://www.digikey.com/product-detail/en/yageo/RC0603FR-07120RL/311-120HRCT-ND/729867; VPN: 311-120HRCT-ND
R37 R38 = openag-resistors:2.2K-RC0603JR-072K2L: RES SMD 2.2K OHM 5% 1/10W 0603 Description: 2.2 kOhms ±5% 0.1W, 1/10W Chip Resistor 0603 (1608 Metric) Moisture Resistant Thick Film Technical Specifications: Resistance: 2.2 kOhms Tolerance: ±5% Power (Watts): 0.1W, 1/10W Composition: Thick Film Features: Moisture Resistant Temperature Coefficient: ±100ppm/°C Operating Temperature: -55°C ~ 155°C Package / Case: 0603 (1608 Metric) Supplier Device Package: 0603 Size / Dimension: 0.063" L x 0.032" W (1.60mm x 0.80mm) Height - Seated (Max): 0.022" (0.55mm) Number of Terminations: 2 Datasheet(s): RC Series, L Datasheet <http://www.yageo.com/documents/recent/PYu-RC_Group_51_RoHS_L_8.pdf> Chip Resistor Marking <http://www.yageo.com/exep/pages/download/literatures/PYu-R_Marking_2.pdf> Vendor(s): Digikey: 311-2.2KGRCT-ND <https://www.digikey.com/product-detail/en/yageo/RC0603JR-072K2L/311-2.2KGRCT-ND/729676#>; MANUFACTURER: Yageo; MPN: RC0603JR-072K2L; VENDOR: Digikey; VLINK: https://www.digikey.com/product-detail/en/yageo/RC0603JR-072K2L/311-2.2KGRCT-ND/729676#; VPN: 311-2.2KGRCT-ND
R39 R41 = openag-resistors:100OHM-RC0603JR-07100RL: RES SMD 100 OHM 5% 1/10W 0603 Description: 100 Ohms ±5% 0.1W, 1/10W Chip Resistor 0603 (1608 Metric) Moisture Resistant Thick Film Technical Specifications: Resistance: 100 Ohms Tolerance: ±5% Power (Watts): 0.1W, 1/10W Composition: Thick Film Features: Moisture Resistant Temperature Coefficient: ±100ppm/°C Operating Temperature: -55°C ~ 155°C Package / Case: 0603 (1608 Metric) Supplier Device Package: 0603 Size / Dimension: 0.063" L x 0.032" W (1.60mm x 0.80mm) Height - Seated (Max): 0.022" (0.55mm) Number of Terminations: 2 Datasheet(s): Thick Film Chip Resistor Intro <http://www.yageo.com.tw/exep/pages/download/literatures/PYu-R_INT-thick_7.pdf> Chip Resistor Marking <http://www.yageo.com/exep/pages/download/literatures/PYu-R_Marking_2.pdf> RC Series, L Datasheet <http://www.yageo.com/documents/recent/PYu-RC_Group_51_RoHS_L_8.pdf> Vendor(s): Digikey: 311-100GRCT-ND <https://www.digikey.com/product-detail/en/yageo/RC0603JR-07100RL/311-100GRCT-ND/729644>; MANUFACTURER: Yageo; MPN: RC0603JR-07100RL; VENDOR: Digikey; VLINK: https://www.digikey.com/product-detail/en/yageo/RC0603JR-07100RL/311-100GRCT-ND/729644; VPN: 311-100GRCT-ND
RS1 RS3-RS6 RS8 = openag-resistors:6.3OHM-RC0805FR-076R34L: Yageo - RC0805FR-076R34L - RES SMD 6.34 OHM 1% 1/8W 0805 Description: 6.34 Ohms ±1% 0.125W, 1/8W Chip Resistor 0805 (2012 Metric) Moisture Resistant Thick Film Technical Specifications: Resistance: 6.34 Ohms Tolerance: ±1% Power: 0.125W, 1/8W Temperature Coefficient: ±200ppm/°C Operating Temperature: -55°C ~ 155°C Packaging / Case: 0805 (2012 Metric) Datasheet(s): RC Series, L Datasheet Vendor(s): Digikey: 311-6.34CRCT-ND <https://www.digikey.com/product-detail/en/yageo/RC0805FR-076R34L/311-6.34CRCT-ND/731003>; POPULATE: YES; VERIFIED: NO
SJ1 = openag-connectors:EMI-BYPASS: EMI Bypass Solder Jumper; MPN: N/A
SJ_A16 SJ_A17 = openag-connectors:SOLDERJUMPER: SMD Solder JUMPER Solder the two pads together to create a connection, or remove the solder to break it. REFLOW - Use this footprint for solder paste and reflow ovens. WAVE - Use this footprint for hand-soldering (larger pads). CLOSED - Has a trace between the two pads to ensure it is closed by default. The trace needs to be cut to disable the jumper, and can be closed again by creating a solder bridge between the two pads.; MPN: N/A
TP1 TP2 TP10-TP42 TP44 TP45 TP48 TP49 TP51-TP65 TP73 TP74 TP80-TP84 = openag-testpads:TP: Test pad; MPN: N/A
U7 = openag-dacs:DAC5578SPW: IC DAC 8BIT I2C OCTAL 16TSSOP Description: 8 Bit Digital to Analog Converter 8 16-TSSOP Technical Specifications: Number of Bits: 8 Number of D/A Converters: 8 Settling Time: 12µs (Typ) Output Type: Voltage - Buffered Differential Output: No Data Interface: I²C Reference Type: External Voltage - Supply, Analog: 2.7 V ~ 5.5 V Voltage - Supply, Digital: 2.7 V ~ 5.5 V INL/DNL (LSB): ±0.01, ±0.01 Architecture: String DAC Operating Temperature: -40°C ~ 125°C Package / Case: 16-TSSOP (0.173", 4.40mm Width) Supplier Device Package: 16-TSSOP Base Part Number: DAC5578 Datasheet(s): DAC5578,6578,7578 <http://www.ti.com/lit/ds/symlink/dac5578.pdf> Analog Signal Chain Guide <http://www.ti.com/lit/pdf/slyb174> Vendor(s): Digikey: 296-27736-5-ND <https://www.digikey.com/product-detail/en/texas-instruments/DAC5578SPW/296-27736-5-ND/2360827>; MANUFACTURER: Texas Instruments; MPN: DAC5578SPW; VENDOR: Digikey; VLINK: https://www.digikey.com/product-detail/en/texas-instruments/DAC5578SPW/296-27736-5-ND/2360827; VPN: 296-27736-5-ND
U11 = openag-buffers:PCA9615DPJ: IC REDRIVER I2C 2CH 10TSSOP Description: Buffer, ReDriver 2 Channel 400kHz 10-TSSOP Technical Specifications: Type: Buffer, ReDriver Applications: I²C Input: 2-Wire Bus Output: 2-Wire Bus Data Rate (Max): 400kHz Number of Channels: 2 Capacitance - Input: 7pF Voltage - Supply: 2.3 V ~ 5.5 V Current - Supply: 16µA Operating Temperature: -40°C ~ 85°C Package / Case: 10-TFSOP, 10-MSOP (0.118", 3.00mm Width) Supplier Device Package: 10-TSSOP Base Part Number: PCA9615 Datasheet(s): PCA9615DP <http://www.nxp.com/documents/data_sheet/PCA9615.pdf> Vendor(s): Digikey: 568-11484-1-ND <https://www.digikey.com/product-detail/en/nxp-usa-inc/PCA9615DPJ/568-11484-1-ND/4864508>; MANUFACTURER: NXP USA Inc.; MPN: PCA9615DPJ; VENDOR: Digikey; VLINK: https://www.digikey.com/product-detail/en/nxp-usa-inc/PCA9615DPJ/568-11484-1-ND/4864508; VPN: 568-11484-1-ND
U13 = openag-regulators:LM2937IMP-3.3/NOPB: IC REG LIN 3.3V 400MA SOT223-4 Description: Linear Voltage Regulator IC Positive Fixed 1 Output 3.3V 400mA SOT-223-4 Technical Specifications: Output Configuration: Positive Output Type: Fixed Number of Regulators: 1 Voltage - Input (Max): 26V Voltage - Output (Min/Fixed): 3.3V Voltage Dropout (Max): 1V @ 50mA Current - Output: 400mA Current - Quiescent (Iq): 2mA Current - Supply (Max): 1.25A Protection Features: Over Temperature, Reverse Polarity, Short Circuit Operating Temperature: -40°C ~ 85°C Mounting Type: Surface Mount Package / Case: TO-261-4, TO-261AA Supplier Device Package: SOT-223-4 Base Part Number: LM2937 Datasheet(s): LM2937-2.5, LM2937-3.3 Datasheet <http://www.ti.com/lit/ds/symlink/lm2937-2.5.pdf> Vendor(s): Digikey: LM2937IMP-3.3/NOPBCT-ND <https://www.digikey.com/product-detail/en/texas-instruments/LM2937IMP-3.3-NOPB/LM2937IMP-3.3-NOPBCT-ND/270742#>; MANUFACTURER: Texas Instruments; MPN: LM2937IMP-3.3/NOPB; VENDOR: Digikey; VLINK: https://www.digikey.com/product-detail/en/texas-instruments/LM2937IMP-3.3-NOPB/LM2937IMP-3.3-NOPBCT-ND/270742#; VPN: LM2937IMP-3.3/NOPBCT-ND
U17 = openag-regulators:R-78E5.0-1.0: DC/DC CONVERTER 5V 5W Description: Linear Regulator Replacement DC DC Converter 1 Output 5V 1A 8V - 28V Input Technical Specifications: Type: Linear Regulator Replacement Number of Outputs: 1 Voltage - Input (Min): 8V Voltage - Input (Max): 28V Voltage - Output 1: 5V Current - Output (Max): 1A Power (Watts): 5W Applications: ITE (Commercial) Features: SCP Operating Temperature: -40°C ~ 85°C Efficiency: 91% Mounting Type: Through Hole Package / Case: 3-SIP Module Size / Dimension: 0.46" L x 0.33" W x 0.41" H (11.6mm x 8.5mm x 10.4mm) Datasheet(s): R-78E-1.0 Series Datasheet <https://www.recom-power.com/pdf/Innoline/R-78Exx-1.0.pdf> Vendor(s): Digikey: 945-2201-ND <https://www.digikey.com/product-detail/en/recom-power/R-78E5.0-1.0/945-2201-ND/4930585>; MANUFACTURER: Recom Power; MPN: R-78E5.0-1.0; VENDOR: Digikey; VLINK: https://www.digikey.com/product-detail/en/recom-power/R-78E5.0-1.0/945-2201-ND/4930585; VPN: 945-2201-ND
U$6 = openag-frames:AUTHOR; AUTHOR: D Poitrast; MPN: N/A
U$7 = openag-frames:TITLE; MPN: N/A; TITLE: Light Controller; URL: github.com/openaginitiative/openag_eagle/proj/light-controller; VER: 3.0
U$11-U$15 U$17 = openag-driver-IC:AL8861: AL8861 LED Driver IC Description: IC LED DRVR REG PWM 1.5A SOT89-5 Technical Specifications: Type: IC Voltage In: 4.5V - 40V Current Out: Up to 1.5A Frequency: 1Mhz Dimming: PWM or Analog Package SOT-89-5 Operating Temperature: -40°C ~ 85°C (TA) Datasheet(s): Diodes AL8861 <https://www.mouser.com/ds/2/115/AL8861-1094677.pdf> Vendor(s): Digikey: Diodes AL8861 <https://www.digikey.com/product-detail/en/diodes-incorporated/AL8861Y-13/AL8861Y-13DICT-ND/6702378>

## Net classes
0 default: width 0.305 mm, drill 0.254 mm, clearance 0.254 mm

## Board
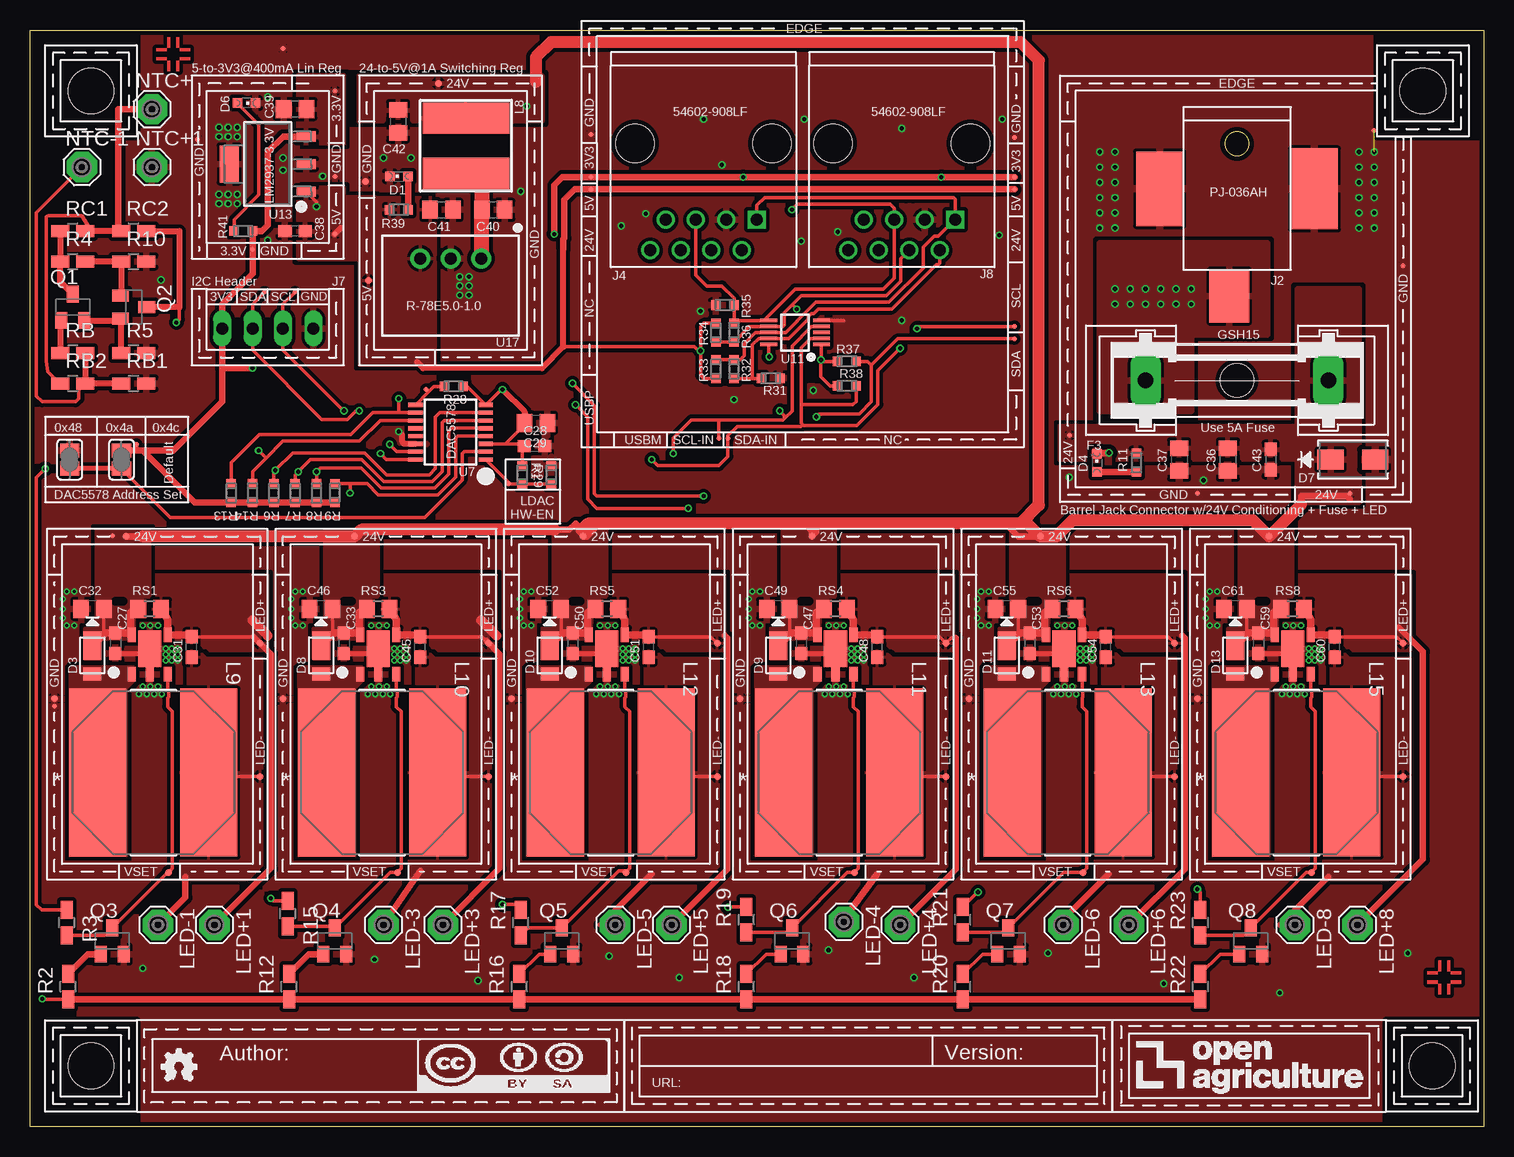
[diagram p2: board, top side]
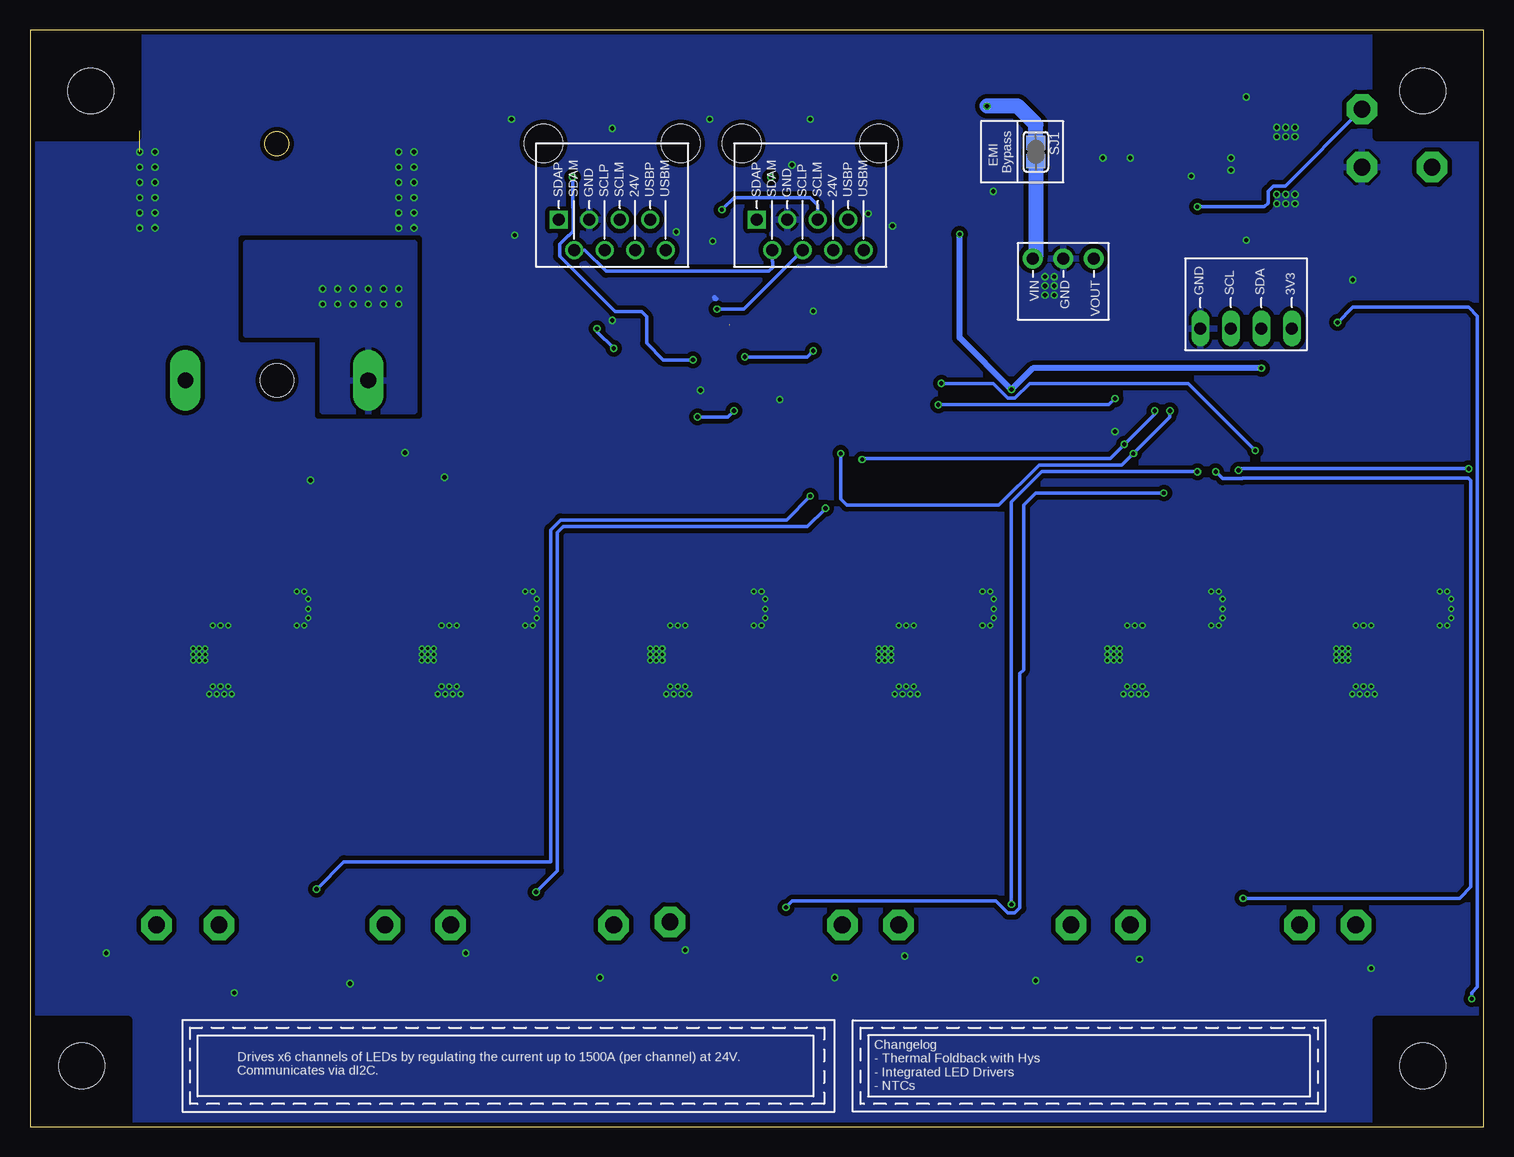
[diagram p3: board, bottom side, seen from below]

Size 121.16 x 91.44 mm. Coordinates in mm from the lower left corner, seen from the top.
Outline: 121.16,0 0,0 0,91.44 121.16,91.44 121.16,0
Copper layers (1*16): Top 0.035559375mm / dielectric 1.6mm / Bottom 0.035559375mm
Design rules "oshpark-2layer-mask": minimum track width 6mil, minimum drill 10mil, track to track 6mil, track to pad 6mil, pad to pad 6mil, via to via 6mil, smd to smd 6mil, copper to edge 15mil, drill to drill 6mil, minimum pad ring 5mil, minimum via ring 5mil, stop-mask expansion 2.5mil, vias tented up to drill 20mil, thermal gap 10mil
tRestrict: 9 lines

### Footprints (pad centres in the part's own frame; a part is rotated, then mirrored left to right if it is on the bottom)
C0603 = smd 1.1 x 1: 1 -0.85,0; 2 0.85,0
C0805 = smd 1.3 x 1.5: 1 -0.95,0; 2 0.95,0
CHIPLED_0603 = smd 0.8 x 0.8: A 0,-0.75; C 0,0.75
POWERDI123 = smd 1.05 x 1.5: + -1.3,0 | smd 2.4 x 1.5: - 1.05,0
SMA = smd 2.18 x 1.63: 1 -1.857,0; 2 1.857,0
GSH15 = drill 1.321 pad 2.54 long: 1 -7.62,0; 2 7.62,0 | hole 2.794: 0,0
BARREL-JACK-PJ-036AH = smd 4.4 x 3.3: 1 2.2,-0.65 | smd 6.75 x 3.9: 2 -6.75,6.45 | smd 6.2 x 3.9: 3 -6.75,-6.45
RJ45-DI2C-USB-54602-908LF = drill 1: 24V(6) 1.905,8.89; DSCLM(5) 0.635,6.35; DSCLP(4) -0.635,8.89; DSDAM(2) -3.175,8.89; GND(3) -1.905,6.35; USBM(8) 4.445,8.89; USBP(7) 3.175,6.35 | drill 1 square: DSDAP(1) -4.445,6.35 | hole 3.2: -5.715,0; 5.715,0
HEADER-I2C = drill 1 long: 3V3 3.81,0.762; GND -3.81,0.762; SCL -1.27,0.762; SDA 1.27,0.762
29333C = smd 2.6 x 7.2: 1 -2.3,0; 2 2.3,0
IND_BOURNS_SDR1307 = smd 4.75 x 13.995: 1 -4.623,0; 2 4.623,0
SE14 = drill 1.397 pad 2.54 octagon: MP 0,0
SOT23-BEC = smd 1 x 1.4: B -0.95,-1.1; C 0,1.1; E 0.95,-1.1
RC0603N = smd 0.756 x 0.8: 1 -0.778,0; 2 0.778,0
R0805W = smd 1.5 x 1: 1 -1.052,0; 2 1.052,0
R0805 = smd 1.3 x 1.5: 1 -0.95,0; 2 0.95,0
EMI-BYPASS = smd 1.168 x 1.6: 1 -0.762,0.254; 2 0.762,0.254
SJ1 = smd 1.168 x 1.6: 1 -0.762,0; 2 0.762,0
TP04R = smd 0.4 x 0.4: 1 0,0
TP06R = smd 0.6 x 0.6: TP 0,0
TSSOP16 = smd 0.35 x 1.2: 1 -2.275,-2.925; 2 -1.625,-2.925; 3 -0.975,-2.925; 4 -0.325,-2.925; 5 0.325,-2.925; 6 0.975,-2.925; 7 1.625,-2.925; 8 2.275,-2.925; 9 2.275,2.925; 10 1.625,2.925; 11 0.975,2.925; 12 0.325,2.925; 13 -0.325,2.925; 14 -0.975,2.925; 15 -1.625,2.925; 16 -2.275,2.925
SOP50P490X110-10N = smd 1.4 x 0.3: 1 -2.2,1; 2 -2.2,0.5; 3 -2.2,0; 4 -2.2,-0.5; 5 -2.2,-1; 6 2.2,-1; 7 2.2,-0.5; 8 2.2,0; 9 2.2,0.5; 10 2.2,1
MP04A = smd 1.6 x 0.838: 1 -3.2,2.3; 2 -3.2,0; 3 -3.2,-2.3 | smd 1.6 x 3.099: 4 3.2,0
R-78E5.0-1.0 = drill 1 pad 1.676: 1 -2.54,0; 2 0,0; 3 2.54,0
CORNER = hole 3.81: 0,0
AL8861 = smd 0.68 x 1.2: 1 -1.5,-1.65; 2 0,-1.65; 3 1.5,-1.65; 4 1.5,1.65; 5 -1.5,1.65 | smd 1.93 x 3.05: 44 0,0.475

### Placement (x,y rotation side)
C27  7.11,40.32 270 top
C28  42.04,56.77 0 top
C29  42.16,58.67 0 top
C31  13.46,40.01 90 top
C32  5.21,43.18 180 top
C33  26.16,40.32 270 top
C36  99.82,55.63 270 top
C37  95.76,55.63 270 top
C38  22.1,74.68 180 top
C39  22.1,84.84 180 top
C40  38.61,76.45 0 top
C41  34.29,76.45 0 top
C42  30.67,83.82 270 top
C43  103.38,55.63 270 top
C45  32.51,40.01 90 top
C46  24.26,43.18 180 top
C47  64.26,40.32 270 top
C48  70.61,40.01 90 top
C49  62.36,43.18 180 top
C50  45.21,40.32 270 top
C51  51.56,40.01 90 top
C52  43.31,43.18 180 top
C53  83.31,40.32 270 top
C54  89.66,40.01 90 top
C55  81.41,43.18 180 top
C59  102.36,40.32 270 top
C60  108.71,40.01 90 top
C61  100.46,43.18 180 top
D1  30.73,79.25 90 top
D3  5.21,39.05 90 top
D4  88.9,55.37 0 top
D6  18.03,85.34 270 top
D7  110.24,55.63 0 top
D8  24.26,39.05 90 top
D9  62.36,39.05 90 top
D10  43.31,39.05 90 top
D11  81.41,39.05 90 top
D13  100.46,39.05 90 top
F1  97.54,57.91 0 top
F3  100.58,62.23 0 top
J2  100.58,71.45 270 top
J4  56.13,81.97 180 top
J7  19.81,67.31 180 top
J8  72.64,81.97 180 top
L8  36.32,81.79 270 top
L9  10.29,29.53 0 top
L10  29.34,29.53 0 top
L11  67.44,29.53 0 top
L12  48.39,29.53 0 top
L13  86.49,29.53 0 top
L15  105.54,29.53 0 top
LED+1  15.37,16.83 270 top
LED+3  34.42,16.83 270 top
LED+4  72.52,16.83 270 top
LED+5  53.47,16.83 270 top
LED+6  91.57,16.83 270 top
LED+8  110.62,16.83 270 top
LED-1  10.67,16.83 270 top
LED-3  29.46,16.83 270 top
LED-4  67.82,17.08 270 top
LED-5  48.77,16.83 270 top
LED-6  86.11,16.83 270 top
LED-8  105.41,16.83 270 top
NTC+  10.16,84.84 0 top
NTC+1  10.16,80.01 0 top
NTC-  4.32,80.01 0 top
NTC-1  4.32,80.01 0 top
Q1  3.56,68.33 0 top
Q2  8.64,68.33 270 top
Q3  6.86,15.49 0 top
Q4  25.4,15.49 0 top
Q5  44.32,15.49 0 top
Q6  63.5,15.49 0 top
Q7  81.53,15.49 0 top
Q8  101.73,15.49 0 top
R1  41.02,54.36 270 top
R2  3.17,11.68 90 top
R3  3.05,17.02 270 top
R4  3.56,72.14 0 top
R5  8.64,64.52 0 top
R6  20.32,52.83 270 top
R7  22.1,52.83 270 top
R8  23.88,52.83 270 top
R9  25.4,52.83 270 top
R10  8.64,72.14 0 top
R11  92.2,55.37 90 top
R12  21.59,11.68 90 top
R13  16.76,52.83 270 top
R14  18.54,52.83 270 top
R15  21.46,17.78 270 top
R16  40.77,11.68 90 top
R17  40.89,17.02 90 top
R18  59.69,11.68 90 top
R19  59.69,17.27 90 top
R20  77.72,11.68 90 top
R21  77.72,17.27 90 top
R22  97.54,11.68 90 top
R23  97.54,17.02 90 top
R28  35.31,61.72 180 top
R29  43.43,54.36 270 top
R31  61.72,62.41 0 top
R32  58.67,63.17 270 top
R33  57.15,63.17 90 top
R34  57.15,66.22 90 top
R35  57.91,68.5 0 top
R36  58.67,66.22 270 top
R37  68.07,63.8 180 top
R38  68.07,61.77 180 top
R39  30.73,76.45 180 top
R41  17.78,74.68 0 top
RB  3.56,64.52 0 top
RB1  8.64,61.98 0 top
RB2  3.56,61.98 0 top
RC1  3.56,74.68 0 top
RC2  8.64,74.68 0 top
RS1  9.97,43.18 180 top
RS3  29.02,43.18 180 top
RS4  67.12,43.18 180 top
RS5  48.07,43.18 180 top
RS6  86.17,43.18 180 top
RS8  105.22,43.18 180 top
SJ1  37.59,81.28 270 bottom
SJ_A16  7.62,55.63 270 top
SJ_A17  3.3,55.63 270 top
TP1  109.98,52.83 0 top
TP2  97.28,52.83 0 top
TP10  19.18,29.21 180 top
TP11  8,49.21 180 top
TP12  6.86,49.28 270 top
TP13  8.89,56.9 270 top
TP14  21.08,89.92 90 top
TP15  19.56,69.6 270 top
TP16  22.1,69.6 270 top
TP17  39.88,53.59 270 top
TP18  2.03,35.69 180 top
TP19  19.18,40.32 270 top
TP20  11.56,21.21 270 top
TP21  38.23,29.21 180 top
TP22  27.05,49.21 180 top
TP23  21.08,35.69 180 top
TP24  38.23,40.32 270 top
TP25  30.61,21.21 270 top
TP26  76.33,29.21 180 top
TP27  65.15,49.21 180 top
TP28  59.18,35.69 180 top
TP29  76.33,40.32 270 top
TP30  68.71,21.21 270 top
TP31  57.28,29.21 180 top
TP32  33.02,61.47 270 top
TP33  2.03,35.05 180 top
TP34  112.01,83.06 0 top
TP35  114.43,71.75 0 top
TP36  86.61,57.66 0 top
TP37  46.1,49.21 180 top
TP38  40.13,35.69 180 top
TP39  57.28,40.32 270 top
TP40  46.74,79.17 270 top
TP41  46.74,78.16 270 top
TP42  46.74,82.73 270 top
TP44  57.4,57.4 270 top
TP45  58.17,57.4 270 top
TP48  82.04,79.17 270 top
TP49  82.04,78.16 270 top
TP51  82.04,82.47 270 top
TP52  82.04,66.73 270 top
TP53  82.04,65.71 270 top
TP54  28.19,70.55 180 top
TP55  34.04,87 180 top
TP56  27.94,78.8 180 top
TP57  18.54,73.15 90 top
TP58  25.4,74.42 90 top
TP59  13.97,82.3 90 top
TP60  25.4,86.36 90 top
TP61  25.4,79.25 90 top
TP62  49.66,21.21 270 top
TP63  95.38,29.21 180 top
TP64  84.2,49.21 180 top
TP65  78.23,35.69 180 top
TP73  95.38,40.32 270 top
TP74  87.76,21.21 270 top
TP80  114.43,29.21 180 top
TP81  103.25,49.21 180 top
TP82  97.28,35.69 180 top
TP83  114.43,40.32 270 top
TP84  106.81,21.21 270 top
U7  35.05,57.91 90 top
U11  63.75,66.22 180 top
U13  19.81,80.26 180 top
U17  35.05,72.39 180 top
U$1  [CORNER]  5.08,5.08 0 top
U$2  [CORNER]  116.84,5.08 90 top
U$3  [CORNER]  5.08,86.36 270 top
U$4  [CORNER]  116.08,86.36 180 top
U$6  8.89,1.27 0 top
U$7  49.53,1.27 0 top
U$8  [LOGO]  90.17,1.27 0 top
U$10  [PASSER]  11.94,89.41 0 top
U$11  9.97,39.37 0 top
U$12  29.02,39.37 0 top
U$13  67.12,39.37 0 top
U$14  48.07,39.37 0 top
U$15  86.17,39.37 0 top
U$16  [PASSER]  117.86,12.45 0 top
U$17  105.22,39.37 0 top

### Tracks (layer width: path | path; a pad name or v marks a point on that pad's centre or on a via)
24V_EMI
  Top 1.27: U17.1 37.66,72.46 C40.1 37.66,78.15 arc90 L8.2
  Bottom 1.27: SJ1.2 37.34,72.64 U17.1
24V_IN  (via drill 0.35)
  other vias: 96.77,69.85 96.77,68.58 95.5,69.85 95.5,68.58 94.23,69.85 94.23,68.58 92.96,69.85 91.69,69.85 91.69,68.58 92.96,68.58 90.42,68.58 90.42,69.85
  pour Bottom (isolate 0.406): 96.77,59.69 89.15,59.69 89.15,73.66 103.12,73.66 103.12,66.04 96.77,66.04
  pour Top (isolate 0.406): 89.15,59.69 96.77,59.69 96.77,66.04 103.12,66.04 103.12,73.66 89.15,73.66
!LDAC!
  Top 0.305: R29.2 R1.2 40.39,53.58 40.04,53.58 | U7.1 40.04,53.58 | TP17.1 39.89,53.58 40.04,53.58
+3V3  (via drill 0.35)
  Top 0.305: v65.91,63.93 66.04,63.8 R37.2 | v65.91,63.93 65.91,62.53 66.67,61.77 R38.2 | U11.1 65.95,63.97 v65.91,63.93 | U7.3 39.62,56.94 | 39.62,56.94 40.89,56.94 | 40.89,56.94 41.02,56.94 C28.1 | C29.1 41.21,58.53 39.62,56.94 | R1.1 41.02,56.81 40.89,56.94 | R28.1 36.44,61.72 U7.8 39.26,61.47 v39.37,61.47 | TP13.1 8.89,56.39
  Top 0.508: 16,63.25 v18.54,63.25 | v39.37,61.47 41.21,59.62 C29.1
  Top 0.559: TP48.1 v75.95,79.17 v59.44,79.17 TP40.1 44.37,79.17 43.69,78.49 v43.69,74.42 | U13.3 21.1,82.56 19.81,81.28 19.81,75.18 19.3,74.68 R41.2 18.54,74.66 TP57.1 18.54,71.12 16,68.58 J7.3V3 16,63.25 16,60.45 11.94,56.39 9.4,56.39 | SJ_A16.1 8.89,56.39 9.4,56.39 | R9.2 R8.2 R7.2 R6.2 R14.2 R13.2 13.73,52.05 9.4,56.39
  Bottom 0.305: v75.95,79.17 75.95,76.62 75.88,76.56 75.88,74.68 76.28,74.28 76.32,74.28 77.03,73.58 77.03,72.58 72.39,67.94 70.19,67.94 69.78,67.53 69.78,65.33 68.38,63.93 v65.91,63.93
  Bottom 0.508: v18.54,63.25 37.59,63.25 v39.37,61.47 43.69,65.79 v43.69,74.42
  pour Top (isolate 0.305): 26.16,87.63 22.35,87.63 22.35,82.04 26.16,82.04
+5V  (via drill 0.35)
  Top 0.305: v61.59,64.19 61.55,64.23 U11.10 | R34.2 56.15,67 55.88,66.73 v55.88,64.69 55.88,64.52 | R33.1 56.15,62.39 55.88,62.66 55.88,64.52 | U13.1 23.88,77.1 v23.88,76.71 | RB2.1 1.49,62.95 1.35,63.85 1.35,75.87 1.52,75.95 4.32,75.95 4.83,75.18 4.61,74.97 RC1.2 | 44.45,65.02 55.37,65.02 55.88,64.52
  Top 0.508: RC2.1 7.37,74.68 RC1.2 | 44.45,73.15 44.45,65.02 42.67,63.25 32.77,63.25 32.26,63.75
  Top 0.559: TP49.1 TP41.1 45.39,78.16 44.52,77.29 44.52,74.08 44.45,74 44.45,73.15 | TP58.1 25.91,74.93 | NTC+.MP 7.37,84.84 7.37,74.68
  Bottom 0.305: v61.59,64.19 56.39,64.19 v55.88,64.69 | v23.88,76.71 18.29,76.71 17.98,77.02 17.98,78.02 17.57,78.43 16.56,78.43 NTC+.MP
  pour Top (isolate 0.305): 27.43,63.5 27.43,77.47 33.78,77.47 33.78,63.5
  pour Top (isolate 0.305): 26.16,72.39 26.16,78.23 22.35,78.23 22.35,72.39
  pour Top (isolate 0.406): 28.7,77.47 24.89,77.47 24.89,72.39 28.7,72.39
+24V  (via drill 0.35)
  Top 0.305: TP1.1 109.98,52.32 | C32.1 6.16,41.29 6.28,41.17 | C46.1 25.21,41.29 25.33,41.17 | C52.1 44.26,41.29 44.38,41.17 | C49.1 63.31,41.29 63.43,41.17 | C55.1 82.36,41.29 82.48,41.17 | C61.1 101.41,41.29 101.53,41.17
  Top 0.559: 105.92,51.88 105.92,52.58 109.73,52.58 109.98,52.32 | TP64.TP 82.36,49.21 81.28,50.29 65.53,50.29 65.53,49.59 TP27.TP 65.15,49.66 64.52,50.29 61.47,50.29 47.5,50.29 46.42,49.21 TP37.TP 46.1,49.66 45.97,49.78 45.47,50.29 44.96,49.78 43.69,49.78 | 9.4,49.21 TP11.TP
  Top 0.61: RS1.2 8.38,42.86 8.38,40.96 8.17,41.17 C27.1 6.28,41.17 5.48,40.37 D3.- | RS3.2 27.43,42.86 27.43,40.96 27.22,41.17 C33.1 25.33,41.17 24.53,40.37 D8.- | RS5.2 46.48,42.86 46.48,40.96 46.27,41.17 C50.1 44.38,41.17 43.58,40.37 D10.- | RS4.2 65.53,42.86 65.53,40.96 65.32,41.17 C47.1 63.43,41.17 62.63,40.37 D9.- | RS6.2 84.58,42.86 84.58,40.96 84.37,41.17 C53.1 82.48,41.17 81.68,40.37 D11.- | RS8.2 103.63,42.86 103.63,40.96 103.42,41.17 C59.1 101.53,41.17 100.73,40.37 D13.-
  Top 1.016: 105.92,51.88 TP81.TP 101.92,50.55 86.87,50.55 85.53,49.21 TP64.TP 83.12,50.29 82.55,50.29 | 82.55,50.29 61.47,50.29 46.48,50.29 45.97,49.78 | 43.69,49.78 27.62,49.78 TP22.TP 9.4,49.21 | 82.55,50.29 84.07,51.82 84.07,88.9 82.55,90.42 43.43,90.42 42.16,89.15 42.16,87.12
  Bottom 1.27: SJ1.1 37.34,83.57 38.86,85.09 v41.4,85.09
  pour Top (isolate 0.406): 27.43,83.82 27.43,87.63 42.67,87.63 42.67,83.82
  pour Top (isolate 0.406): 110.74,52.07 110.74,69.85 105.66,69.85 105.66,52.07
  pour Top (isolate 0.406): 106.17,58.42 106.17,55.63 85.85,55.63 85.85,58.42
  pour Top (isolate 0.305, no thermals): 5.84,39.05 4.57,39.05 4.57,41.59 5.52,41.59 5.52,49.85 9.97,49.85 9.97,44.13 9.33,44.13 9.33,42.55 8.7,42.55 8.7,40.64 5.84,40.64
  pour Top (isolate 0.305, no thermals): 24.89,39.05 23.62,39.05 23.62,41.59 24.57,41.59 24.57,49.85 29.02,49.85 29.02,44.13 28.38,44.13 28.38,42.55 27.75,42.55 27.75,40.64 24.89,40.64
  pour Top (isolate 0.305, no thermals): 43.94,39.05 42.67,39.05 42.67,41.59 43.62,41.59 43.62,49.85 48.07,49.85 48.07,44.13 47.43,44.13 47.43,42.55 46.8,42.55 46.8,40.64 43.94,40.64
  pour Top (isolate 0.305, no thermals): 62.99,39.05 61.72,39.05 61.72,41.59 62.67,41.59 62.67,49.85 67.12,49.85 67.12,44.13 66.48,44.13 66.48,42.55 65.85,42.55 65.85,40.64 62.99,40.64
  pour Top (isolate 0.305, no thermals): 82.04,39.05 80.77,39.05 80.77,41.59 81.72,41.59 81.72,49.85 86.17,49.85 86.17,44.13 85.53,44.13 85.53,42.55 84.9,42.55 84.9,40.64 82.04,40.64
  pour Top (isolate 0.305, no thermals): 101.09,39.05 99.82,39.05 99.82,41.59 100.77,41.59 100.77,49.85 105.22,49.85 105.22,44.13 104.58,44.13 104.58,42.55 103.95,42.55 103.95,40.64 101.09,40.64
ADDR0
  Top 0.305: U7.2 36.17,56.29 36.02,56.13 36.02,53.94 32.88,50.8 11.68,50.8 SJ_A16.2
  Top 0.406: SJ_A16.2 SJ_A17.2
DAC_!CLR!
  Top 0.305: U7.9 33.21,61.27 | 33.21,61.27 33.66,61.72 R28.2 | TP32.1 33.21,61.27
DIM1  (via drill 0.35)
  Top 0.305: U7.7 34.14,59.54 33.78,59.18 33.78,54.86 33.27,54.36 29.72,54.36 27.89,56.19 21.89,56.19 v20.45,54.74 20.32,54.61 R6.1 | R3.1 0.98,18.07 0.53,18.52 0.53,54.13 v1.27,54.86
  Bottom 0.305: v1.27,54.86 20.32,54.86 v20.45,54.74
DIM2  (via drill 0.35)
  Top 0.305: U7.6 34.5,58.89 34.34,58.73 34.34,54.63 33.51,53.8 29.49,53.8 27.66,55.63 23.37,55.63 v22.35,54.61 22.1,54.36 R7.1 | R15.1 20.28,18.83 v20.07,19.05
  Bottom 0.305: v20.07,19.05 2.03,19.05 1.09,19.99 1.09,53.9 1.28,54.09 20.09,54.09 20.15,54.03 21.77,54.03 v22.35,54.61
DIM3  (via drill 0.35)
  Top 0.305: U7.5 35.12,58.24 34.9,58.01 34.9,54.4 33.74,53.24 29.25,53.24 27.58,54.91 24.18,54.91 v23.88,54.61 R8.1 | R17.2 40.42,18.54 v39.37,18.54
  Bottom 0.305: v39.37,18.54 39.37,52.07 36.83,54.61 v23.88,54.61
DIM4  (via drill 0.35)
  Top 0.305: R9.1 26.67,53.61 | 26.67,53.61 28.09,53.61 29.02,52.68 33.97,52.68 35.46,54.17 35.46,57.4 35.64,57.59 U7.4 | R19.2 58.2,18.32 v58.17,18.29 | v26.67,52.83 26.67,53.61
  Bottom 0.305: v58.17,18.29 57.62,18.84 40.66,18.84 39.66,17.83 39.08,17.83 38.66,18.25 38.66,37.79 38.35,38.1 38.35,51.82 37.34,52.83 v26.67,52.83
DIM5  (via drill 0.35)
  Top 0.305: U7.10 30.73,59.54 | 30.73,59.54 28.55,59.54 26.72,57.71 19.1,57.71 16.76,55.37 R13.1 | R21.2 78.96,19.56 v78.99,19.56 | v54.86,51.56 47.24,51.56 46.48,52.32 46.48,59.18 v45.47,60.2 | v30.73,60.71 30.73,59.54
  Bottom 0.305: v78.99,19.56 77.22,21.34 77.22,49.53 76.71,50.04 56.39,50.04 v54.86,51.56 | v45.47,60.2 31.24,60.2 v30.73,60.71
DIM6  (via drill 0.35)
  Top 0.305: R14.1 18.54,54.61 19.68,55.75 | 19.68,55.75 21.08,57.15 27.43,57.15 29.17,58.89 U7.11 | R23.2 97.54,19.56 v97.28,19.81 | v56.13,52.58 47.24,52.58 47.04,52.78 47.04,60.15 v45.21,61.98 | v19.05,56.39 19.68,55.75
  Bottom 0.305: v97.28,19.81 95,22.1 77.78,22.1 77.78,49.76 76.94,50.6 58.12,50.6 v56.13,52.58 | v45.21,61.98 40.88,61.98 39.66,60.76 39.08,60.76 37.86,61.98 24.64,61.98 v19.05,56.39
DSCLM_1  (via drill 0.35)
  Top 0.305: U11.6 58.83,67.22 58.71,67.09 R36.1 58.67,67.23 58.67,68.49 R35.2 58.69,69.07 57.66,70.1 56.39,70.1 55.5,70.99 J4.DSCLM(5) | 61.21,67.31 63.75,69.85 71.12,69.85 72.01,70.74 J8.DSCLM(5) 72.01,76.58 71.68,76.91 63.96,76.91 v63.5,76.45
  Bottom 0.305: v63.5,76.45 62.48,77.47 57.09,77.47 57.06,77.45 56.48,77.45 56.45,77.47 56.13,77.47 55.5,76.83 J4.DSCLM(5)
DSCLP_1  (via drill 0.35)  (1 unrouted)
  Top 0.305: R34.1 R36.2 59.95,66.72 U11.7 62.73,66.72 62.87,66.85 | J8.DSCLP(4) 72.57,72.36 72.57,70.51 71.35,69.29 64.26,69.29 63.52,68.56 | 63.52,68.56 62.87,67.89 62.87,66.91 | v63.9,68.18 63.52,68.56 | 62.87,66.91 62.73,66.78 62.76,66.78 62.85,66.87 62.87,66.88 62.87,66.91
  Bottom 0.305: J4.DSCLP(4) 61.67,68.18 v63.9,68.18
DSDAM_1
  Top 0.305: R32.2 60.2,62.39 | 60.2,62.39 60.67,62.39 R31.1 | 60.2,62.39 60.2,65.2 60.71,65.72 U11.9 63.24,65.72 64.85,67.33 64.85,67.54 65.09,67.77 65.29,67.77 65.69,68.17 71.81,68.17 75.52,71.88 75.69,71.88 75.82,72.01 J8.DSDAM(2)
  Bottom 0.305: J8.DSDAM(2) 74.91,73.08 73.16,71.32 59.59,71.32 59.26,71.64 59.26,72.11 59.31,72.16 J4.DSDAM(2)
DSDAP_1
  Top 0.305: R33.2 R32.1 59.2,63.95 59.53,64.28 59.53,65.3 60.45,66.22 U11.8 62.99,66.22 63.94,67.17 63.9,67.17 65.46,68.73 71.58,68.73 74.44,71.58 74.44,73.33 75.34,74.23 75.7,74.23 J8.DSDAP(1) 77.09,77.34 76.96,77.47 73.59,77.47 73.57,77.45 72.99,77.45 72.96,77.47 61.21,77.47 60.58,76.83 J4.DSDAP(1)
GND  (via drill 0.25, 0.35)  (1 unrouted)
  Top 0.305: U11.5 67.29,67.22 | 67.29,67.22 67.31,67.23 | 67.29,67.22 67.8,67.22
  Top 0.406: C27.2 9.6,39.47 U$11.44 9.97,37.78 | C33.2 28.65,39.47 U$12.44 29.02,37.78 | C50.2 47.7,39.47 U$14.44 48.07,37.78 | C47.2 66.75,39.47 U$13.44 67.12,37.78 | C53.2 85.8,39.47 U$15.44 86.17,37.78 | C59.2 104.85,39.47 U$17.44 105.22,37.78
  Top 0.508: U7.14 31.2,56.94 30.99,57.15 30.99,57.71 v30.73,57.96
  Top 0.559: D4.C 88.96,56.19 v89.92,56.19
  Bottom 0.406: 64.14,69.14 64.01,69.01
  other vias: 56.13,84 58.67,60.63 31.75,80.77 40.89,77.98 16.51,77.72 17.27,77.72 16.51,76.96 17.27,76.96 15.75,77.72 15.75,76.96 17.27,82.55 17.27,83.31 16.51,82.55 15.75,82.55 16.51,83.31 15.75,83.31 21.08,79.76 19.81,85.85 21.08,80.77 64.52,84 19.81,73.91 72.64,83.24 64.26,73.84 81.03,84 55.88,68 35.81,70.87 35.81,70.1 36.58,70.1 36.58,70.87 35.81,69.34 36.58,69.34 65.28,61.39 51.31,76.12 29.46,80.77 67.31,74.6 57.66,80.19 72.64,67.23 49.28,75.11 90.42,81.28 90.42,80.01 90.42,78.74 90.42,77.47 90.42,76.2 90.42,74.93 89.15,74.93 89.15,76.2 89.15,77.47 89.15,78.74 89.15,80.01 89.15,81.28 110.74,81.28 110.74,80.01 110.74,78.74 110.74,77.47 110.74,76.2 110.74,74.93 112.01,74.93 112.01,76.2 112.01,77.47 112.01,78.74 112.01,80.01 112.01,81.28 80.77,74.35 24.38,79.25 97.79,53.9 86.61,54.15 10.92,70.61 11.3,38.86 11.3,39.37 11.3,39.88 11.81,39.88 11.81,39.37 11.81,38.86 12.32,38.86 12.32,39.37 12.32,39.88 9.4,41.78 10.03,41.78 10.67,41.78 10.67,36.7 10.03,36.7 9.4,36.7 10.99,36.07 10.35,36.07 9.72,36.07 9.08,36.07 3.68,41.78 3.05,41.78 2.73,42.42 2.73,43.18 2.73,44.01 3.05,44.64 3.68,44.64 30.35,38.86 30.35,39.37 30.35,39.88 30.86,39.88 30.86,39.37 30.86,38.86 31.37,38.86 31.37,39.37 31.37,39.88 28.45,41.78 29.08,41.78 29.72,41.78 29.72,36.7 29.08,36.7 28.45,36.7 30.04,36.07 29.4,36.07 28.77,36.07 28.13,36.07 22.73,41.78 22.1,41.78 21.78,42.42 21.78,43.18 21.78,44.01 22.1,44.64 22.73,44.64 49.4,38.86 49.4,39.37 49.4,39.88 49.91,39.88 49.91,39.37 49.91,38.86 50.42,38.86 50.42,39.37 50.42,39.88 47.5,41.78 48.13,41.78 48.77,41.78 48.77,36.7 48.13,36.7 47.5,36.7 49.09,36.07 48.45,36.07 47.82,36.07 47.18,36.07 41.78,41.78 41.15,41.78 40.83,42.42 40.83,43.18 40.83,44.01 41.15,44.64 41.78,44.64 68.45,38.86 68.45,39.37 68.45,39.88 68.96,39.88 68.96,39.37 68.96,38.86 69.47,38.86 69.47,39.37 69.47,39.88 66.55,41.78 67.18,41.78 67.82,41.78 67.82,36.7 67.18,36.7 66.55,36.7 68.14,36.07 67.5,36.07 66.87,36.07 66.23,36.07 60.83,41.78 60.2,41.78 59.88,42.42 59.88,43.18 59.88,44.01 60.2,44.64 60.83,44.64 87.5,38.86 87.5,39.37 87.5,39.88 88.01,39.88 88.01,39.37 88.01,38.86 88.52,38.86 88.52,39.37 88.52,39.88 85.6,41.78 86.23,41.78 86.87,41.78 86.87,36.7 86.23,36.7 85.6,36.7 87.19,36.07 86.55,36.07 85.92,36.07 85.28,36.07 79.88,41.78 79.25,41.78 78.93,42.42 78.93,43.18 78.93,44.01 79.25,44.64 79.88,44.64 106.55,38.86 106.55,39.37 106.55,39.88 107.06,39.88 107.06,39.37 107.06,38.86 107.57,38.86 107.57,39.37 107.57,39.88 104.65,41.78 105.28,41.78 105.92,41.78 105.92,36.7 105.28,36.7 104.65,36.7 106.24,36.07 105.6,36.07 104.97,36.07 104.33,36.07 98.93,41.78 98.3,41.78 97.98,42.42 97.98,43.18 97.98,44.01 98.3,44.64 98.93,44.64 9.4,13.21 28.7,13.97 37.34,12.19 48.26,14.22 54.1,12.45 66.55,14.73 73.66,12.45 84.84,14.48 94.49,11.94 104.14,11.18 114.81,14.48
  pour Top (isolate 0.406, rank 3): 13.46,72.39 26.16,72.39 26.16,87.63 13.46,87.63
  pour Top (isolate 0.305): 45.97,92.2 45.97,56.64 82.8,56.64 82.8,92.2
  pour Bottom (isolate 0.406): 45.97,56.64 82.8,56.64 82.8,92.2 45.97,92.2
  pour Top (isolate 0.305, rank 2): 27.43,63.5 27.43,87.63 42.67,87.63 42.67,63.5
  pour Bottom (isolate 0.406, rank 2): 42.67,63.5 42.67,87.63 27.43,87.63 27.43,63.5
  pour Bottom (isolate 0.406): 13.46,72.39 13.46,87.63 26.16,87.63 26.16,72.39
  pour Top (isolate 0.305, rank 2): 85.85,52.07 85.85,87.63 115.06,87.63 115.06,52.07
  pour Bottom (isolate 0.406, rank 2): 85.85,87.63 115.06,87.63 115.06,52.07 85.85,52.07
  pour Top (isolate 0.305, rank 4): 0,91.44 121.41,91.95 121.67,-1.02 -1.02,0.51
  pour Bottom (isolate 0.381, rank 4): -0.51,91.19 121.41,91.69 121.92,-0.51 -1.02,0.51 -0.25,88.14
LED+
  Top 0.305: C31.2 18.64,40.85 TP19.TP
  Top 0.559: LED+1.MP 20.07,21.53 20.07,39.43 18.64,40.85
  Top 0.61: RS1.1 11.47,42.31 U$11.4 13.3,41.02 C31.2
  Top 0.813: 19.81,40.96 18.54,42.23
  pour Top (isolate 0.305, rank 2): 11.24,40.64 11.24,42.55 10.29,42.55 10.29,46.04 19.81,46.04 19.81,39.69 14.73,39.69 14.1,40.32 13.14,40.32 13.14,40.64
LED+_2
  Top 0.305: C45.2 37.69,40.85 38.01,40.55 TP24.TP
  Top 0.559: LED+3.MP 39.12,21.53 39.12,39.43 38.01,40.55
  Top 0.61: RS3.1 30.52,42.31 U$12.4 32.35,41.02 C45.2
  Top 0.813: 38.86,40.96 37.59,42.23
  pour Top (isolate 0.305, rank 2): 30.29,40.64 30.29,42.55 29.34,42.55 29.34,46.04 38.86,46.04 38.86,39.69 33.78,39.69 33.15,40.32 32.19,40.32 32.19,40.64
LED+_3
  Top 0.305: C51.2 56.74,40.85 TP39.TP
  Top 0.559: 57.91,40.96 58.11,40.76 58.11,21.47 LED+5.MP
  Top 0.61: RS5.1 49.57,42.31 U$14.4 51.4,41.02 C51.2
  pour Top (isolate 0.305, rank 2): 49.34,40.64 49.34,42.55 48.39,42.55 48.39,46.04 57.91,46.04 57.91,39.69 52.83,39.69 52.2,40.32 51.24,40.32 51.24,40.64
LED+_4
  Top 0.305: C48.2 75.79,40.85 TP29.TP 76.76,40.76 77.16,40.76
  Top 0.559: 77.16,40.76 77.16,21.47 LED+4.MP | 77.16,40.76
  Top 0.61: RS4.1 68.62,42.31 U$13.4 70.45,41.02 C48.2
  pour Top (isolate 0.305, rank 2): 68.39,40.64 68.39,42.55 67.44,42.55 67.44,46.04 76.96,46.04 76.96,39.69 71.88,39.69 71.25,40.32 70.29,40.32 70.29,40.64
LED+_5
  Top 0.305: C54.2 94.84,40.85 TP73.TP
  Top 0.559: 96.01,40.96 96.21,40.76 96.21,21.47 LED+6.MP
  Top 0.61: RS6.1 87.67,42.31 U$15.4 89.5,41.02 C54.2
  pour Top (isolate 0.305, rank 2): 87.44,40.64 87.44,42.55 86.49,42.55 86.49,46.04 96.01,46.04 96.01,39.69 90.93,39.69 90.3,40.32 89.34,40.32 89.34,40.64
LED+_6
  Top 0.305: C60.2 113.89,40.85 TP83.TP
  Top 0.559: LED+8.MP 116.08,22.29 116.08,39.62 114.08,41.62
  Top 0.61: RS8.1 106.72,42.31 U$17.4 108.55,41.02 C60.2
  pour Top (isolate 0.305, rank 2): 106.49,40.64 106.49,42.55 105.54,42.55 105.54,46.04 115.06,46.04 115.06,39.69 109.98,39.69 109.35,40.32 108.39,40.32 108.39,40.64
LED-
  Top 0.305: L9.2 15.23,29.21 TP10.TP
  Top 0.559: LED-1.MP 12.95,19.11 12.95,20.83
  pour Top (isolate 0.305): 13.14,39.69 13.14,36.51 12.51,36.51 12.51,20.64 19.81,20.64 19.81,39.05 14.73,39.05 14.1,39.69
LED-_2
  Top 0.305: L10.2 34.28,29.21 TP21.TP
  Top 0.559: LED-3.MP 29.78,17.34 32.51,21.34
  pour Top (isolate 0.305): 32.19,39.69 32.19,36.51 31.56,36.51 31.56,20.64 38.86,20.64 38.86,39.05 33.78,39.05 33.15,39.69
LED-_3
  Top 0.305: L12.2 53.33,29.21 TP31.TP
  Top 0.559: LED-5.MP 47.56,16.83 51.82,21.08
  pour Top (isolate 0.305): 51.24,39.69 51.24,36.51 50.61,36.51 50.61,20.64 57.91,20.64 57.91,39.05 52.83,39.05 52.2,39.69
LED-_4
  Top 0.305: L11.2 72.38,29.21 TP26.TP
  Top 0.559: LED-4.MP 67.63,17.08 70.61,21.08
  pour Top (isolate 0.305): 70.29,39.69 70.29,36.51 69.66,36.51 69.66,20.64 76.96,20.64 76.96,39.05 71.88,39.05 71.25,39.69
LED-_5
  Top 0.305: L13.2 91.43,29.21 TP63.TP
  Top 0.559: LED-6.MP 85.66,16.83 89.92,21.08
  pour Top (isolate 0.305): 89.34,39.69 89.34,36.51 88.71,36.51 88.71,20.64 96.01,20.64 96.01,39.05 90.93,39.05 90.3,39.69
LED-_6
  Top 0.305: L15.2 110.48,29.21 TP80.TP
  Top 0.559: LED-8.MP 104.2,16.83 108.2,20.83
  pour Top (isolate 0.305): 108.39,39.69 108.39,36.51 107.76,36.51 107.76,20.64 115.06,20.64 115.06,39.05 109.98,39.05 109.35,39.69
LX
  pour Top (isolate 0.305, no thermals): 8.7,38.42 8.7,37.15 8.06,36.51 8.06,22.54 3.3,22.54 3.3,38.1 3.62,38.42
LX_2
  pour Top (isolate 0.305, no thermals): 27.75,38.42 27.75,37.15 27.11,36.51 27.11,22.54 22.35,22.54 22.35,38.1 22.67,38.42
LX_3
  pour Top (isolate 0.305, no thermals): 46.8,38.42 46.8,37.15 46.16,36.51 46.16,22.54 41.4,22.54 41.4,38.1 41.72,38.42
LX_4
  pour Top (isolate 0.305, no thermals): 65.85,38.42 65.85,37.15 65.21,36.51 65.21,22.54 60.45,22.54 60.45,38.1 60.77,38.42
LX_5
  pour Top (isolate 0.305, no thermals): 84.9,38.42 84.9,37.15 84.26,36.51 84.26,22.54 79.5,22.54 79.5,38.1 79.82,38.42
LX_6
  pour Top (isolate 0.305, no thermals): 103.95,38.42 103.95,37.15 103.31,36.51 103.31,22.54 98.55,22.54 98.55,38.1 98.87,38.42
N$1
  Top 0.559: R39.1 31.51,79.22 D1.A
N$3
  Top 0.305: D6.A 19.07,83.55 19.07,77.69 17,75.62 R41.1
N$4
  Top 0.559: D4.A 88.93,54.59 R11.1
N$5
  Top 0.508: Q1.B 2.5,67.12 RB.1
N$6
  Top 0.508: RC1.1 R4.1 2.5,70.48 Q1.C
N$7
  Top 0.508: Q1.E 7.39,67.23 Q2.E 7.58,67.33 R5.1
N$8
  Top 0.559: R2.2 4.83,14.39 Q3.B
N$9
  Top 0.508: Q2.B 7.58,69.32 R10.1 R4.2
N$10
  Top 0.559: R12.2 23.25,14.39 Q4.B
N$11  (via drill 0.35)
  Top 0.305: R2.1 1.05,10.63 v1.02,10.67 | v12.19,67.06 12.45,67.31 12.45,68.33
  Top 0.508: RC2.2 12.45,74.68 12.45,68.33 Q2.C
  Top 0.559: R2.1 R12.1 R16.1 R18.1 R20.1 R22.1
  Bottom 0.305: v1.02,10.67 1.02,11.18 0.53,11.66 0.53,67.59 1.27,68.33 10.92,68.33 v12.19,67.06
N$12
  Top 0.305: R16.2 42.42,14.39 Q5.B
N$22
  Top 0.305: R18.2 61.35,14.39 Q6.B
N$23
  Top 0.305: R20.2 79.38,14.39 Q7.B
N$24
  Top 0.305: R22.2 99.19,14.39 Q8.B
N$25
  Top 0.305: RB2.2 4.06,61.43 4.06,60.71 3.81,60.45 1.02,60.45 0.53,60.94 0.53,76.22 NTC-1.MP
  Top 0.508: RB.2 RB2.2 5.08,61.98 RB1.1
SCL  (via drill 0.35)
  Top 0.305: U7.16 29.71,55.64 v29.21,56.13 | v26.16,59.69 21.08,64.77 J7.SCL 21.08,68.58 TP16.1 | U11.4 65.12,66.72 63.5,65.1 63.5,59.69 62.87,59.05 | 62.87,59.05 62.74,58.93 57.4,58.93 | 57.4,58.93 55.12,58.93 53.59,57.4 v53.59,56.13 | R37.1 69.8,63.8 70.1,63.5 | 70.1,63.5 70.1,60.45 69.09,59.44 65.79,59.44 v65.53,59.18 | v62.48,59.69 62.87,59.31 62.87,59.05 | 70.1,63.5 72.31,65.71 TP53.1 | TP44.1 57.4,58.93
  Bottom 0.305: v26.16,59.69 26.16,59.18 v29.21,56.13 30.18,55.17 37.06,55.17 40.41,51.82 53.09,51.82 53.59,52.32 v53.59,56.13 | v65.53,59.18 62.99,59.18 v62.48,59.69
SDA  (via drill 0.35)
  Top 0.305: U7.15 30.58,56.29 v29.97,56.9 | v27.43,59.69 27.16,59.69 26.45,58.98 24.33,58.98 18.54,64.77 J7.SDA 18.54,68.58 TP15.1 | U11.2 65.03,65.72 64.26,64.95 64.26,60.2 | R38.1 68.85,60.47 68.58,60.2 64.26,60.2 | v72.51,64.9 70.66,63.06 70.66,60.22 68.92,58.47 64.46,58.47 64.39,58.55 | v73.91,66.55 74.09,66.73 TP52.1 | 64.39,58.55 64.26,58.67 64.26,60.2 | v51.82,55.63 52.32,55.12 57.4,55.12 58.17,55.88 TP45.1 58.17,57.61 58.93,58.37 64.21,58.37 64.39,58.55
  Bottom 0.305: v27.43,59.69 27.43,59.44 v29.97,56.9 31.14,55.73 51.71,55.73 v51.82,55.63 | v72.51,64.9 73.91,66.31 v73.91,66.55
VSET
  Top 0.305: U$11.3 11.47,36.37 11.54,36.3 11.54,35.84 11.47,35.76 11.47,35.01 11.87,34.61 11.87,21.53 11.68,21.34 | 11.68,21.34 TP20.TP | R3.2 6.23,15.97 Q3.C 11.6,21.34 11.68,21.34
VSET_2
  Top 0.305: U$12.3 30.52,36.37 30.59,36.3 30.59,35.84 30.52,35.76 30.52,35.01 30.92,34.61 30.92,21.53 TP25.TP 30.02,21.21 Q4.C 25.27,16.73 R15.2
VSET_3
  Top 0.305: U$14.3 49.57,36.37 49.64,36.3 49.64,35.84 49.57,35.76 49.57,35.01 49.97,34.61 49.97,21.53 49.78,21.34 | 49.78,21.34 TP62.TP | R17.1 41.52,16.59 Q5.C 49.06,21.34 49.78,21.34
VSET_4
  Top 0.305: U$13.3 68.62,36.37 68.69,36.3 68.69,35.84 68.62,35.76 68.62,35.01 69.03,34.61 69.03,21.53 TP30.TP 68.11,21.21 Q6.C 63.13,16.22 R19.1
VSET_5
  Top 0.305: U$15.3 87.67,36.37 87.74,36.3 87.74,35.84 87.67,35.76 87.67,35.01 88.08,34.61 88.08,21.53 TP74.TP 86.15,21.21 Q7.C 81.16,16.22 R21.1
VSET_6
  Top 0.305: U$17.3 106.72,36.37 106.79,36.3 106.79,35.84 106.72,35.76 106.72,35.01 107.12,34.61 107.12,21.53 TP84.TP 106.34,21.21 Q8.C 101.1,15.97 R23.1

### Text on the board
tPlace: EDGE | 5-to-3V3@400mA Lin Reg | 24-to-5V@1A Switching Reg | 24V | EDGE | GND | 3.3V | GND | 3V3 | GND | GND | 3V3 | GND | 5V | 5V | 5V | 24V | 24V | 3.3V | GND | GND | GND | I2C Header | 5V | NC | SCL | SDA | USBP | 0x48 | 0x4a | 0x4c | SCL-IN | Default | USBM | SDA-IN | NC | 24V | DAC5578 Address Set | LDAC / HW-EN | GND | 24V | Barrel Jack Connector w/24V Conditioning + Fuse + LED | 24V | 24V | 24V | 24V | 24V | 24V | LED+ | LED+ | LED+ | LED+ | LED+ | LED+ | GND | GND | GND | GND | GND | GND | LED- | LED- | LED- | LED- | LED- | LED- | VSET | VSET | VSET | VSET | VSET | VSET
bPlace: Drives x6 channels of LEDs by regulating the current up to 1500A (per channel) at 24V. / Communicates via dI2C. | Changelog / - Thermal Foldback with Hys / - Integrated LED Drivers / - NTCs